# EAGLE schematic 3piRB (EAGLE 8.0.2)

## Sheet 1 of 9: CPU Control Processor Unit - XMEGA
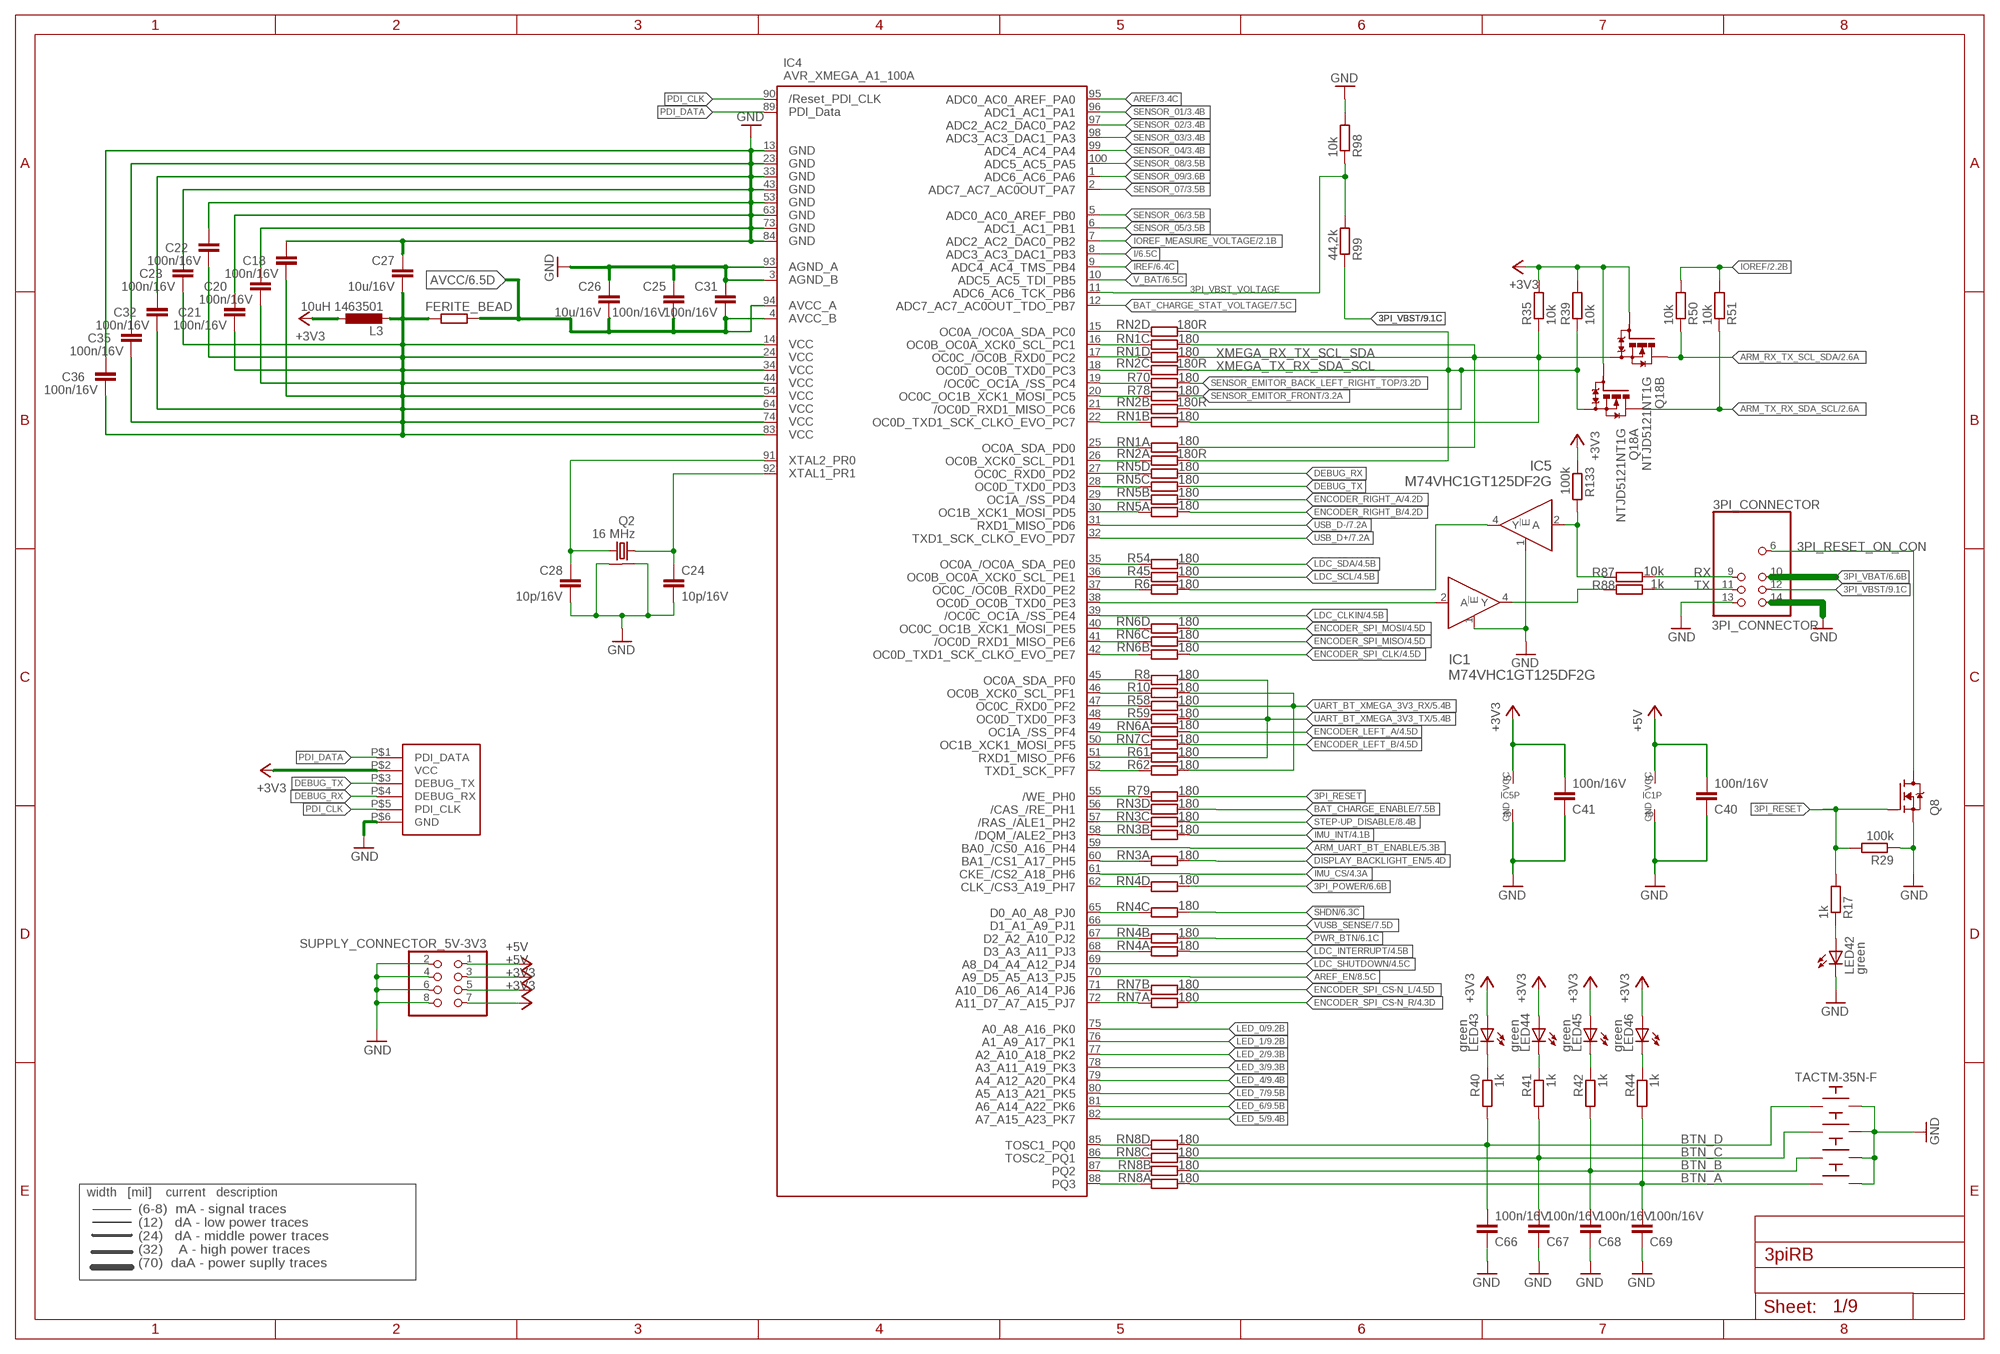
[diagram p0: schematic, sheet 1]

### Parts
3PI_CONNECTOR  3PI_CONNECTOR  3PI_BT_CONNECTOR  [3PI_BT_CONNECTOR]
BTN_A  TACTM-35N-F  [TACTM-35N-F]
BTN_B  TACTM-35N-F  [TACTM-35N-F]
BTN_C  TACTM-35N-F  [TACTM-35N-F]
BTN_D  TACTM-35N-F  [TACTM-35N-F]
C18  100n/16V  C-EUC0402  [C0402]
C20  100n/16V  C-EUC0402  [C0402]
C21  100n/16V  C-EUC0402  [C0402]
C22  100n/16V  C-EUC0402  [C0402]
C23  100n/16V  C-EUC0402  [C0402]
C24  10p/16V  C-EUC0603  [C0603]
C25  100n/16V  C-EUC0402  [C0402]
C26  10u/16V  C-EUC0805  [C0805]
C27  10u/16V  C-EUC0805  [C0805]
C28  10p/16V  C-EUC0603  [C0603]
C31  100n/16V  C-EUC0402  [C0402]
C32  100n/16V  C-EUC0402  [C0402]
C35  100n/16V  C-EUC0402  [C0402]
C36  100n/16V  C-EUC0402  [C0402]
C40  100n/16V  C-EUC0402  [C0402]
C41  100n/16V  C-EUC0402  [C0402]
C66  100n/16V  C-EUC0402  [C0402]
C67  100n/16V  C-EUC0402  [C0402]
C68  100n/16V  C-EUC0402  [C0402]
C69  100n/16V  C-EUC0402  [C0402]
FERITE_BEAD  R-EU_R0603  [R0603]
IC1  M74VHC1GT125DF2G  741G125  [SOT353]
IC4  AVR_XMEGA_A1_100A  [TQFP100]
IC5  M74VHC1GT125DF2G  741G125  [SOT353]
JP3  CON_PROG-6SMD  [SMD-6]
L3  10uH 1463501  L-EUSMD0603  [R0603]
LED42  green  LEDCHIPLED_0603  [CHIPLED_0603]
LED43  green  LEDCHIPLED_0603  [CHIPLED_0603]
LED44  green  LEDCHIPLED_0603  [CHIPLED_0603]
LED45  green  LEDCHIPLED_0603  [CHIPLED_0603]
LED46  green  LEDCHIPLED_0603  [CHIPLED_0603]
Q2  16 MHz  ABM8  [ABM8]
Q8  N-MOSFET-SOT323-GSD  [SOT323]
Q18  NTJD5121NT1G  [SOT363]
R6  180  RESISTOR_0402MP  [_0402MP]
R8  180  RESISTOR_0402MP  [_0402MP]
R10  180  RESISTOR_0402MP  [_0402MP]
R17  1k  RESISTOR_0402MP  [_0402MP]
R29  100k  RESISTOR_0402MP  [_0402MP]
R35  10k  RESISTOR_0402MP  [_0402MP]
R39  10k  RESISTOR_0402MP  [_0402MP]
R40  1k  RESISTOR_0402MP  [_0402MP]
R41  1k  RESISTOR_0402MP  [_0402MP]
R42  1k  RESISTOR_0402MP  [_0402MP]
R44  1k  RESISTOR_0402MP  [_0402MP]
R45  180  RESISTOR_0402MP  [_0402MP]
R50  10k  RESISTOR_0402MP  [_0402MP]
R51  10k  RESISTOR_0402MP  [_0402MP]
R54  180  RESISTOR_0402MP  [_0402MP]
R58  180  RESISTOR_0402MP  [_0402MP]
R59  180  RESISTOR_0402MP  [_0402MP]
R61  180  RESISTOR_0402MP  [_0402MP]
R62  180  RESISTOR_0402MP  [_0402MP]
R70  180  RESISTOR_0402MP  [_0402MP]
R78  180  RESISTOR_0402MP  [_0402MP]
R79  180  RESISTOR_0402MP  [_0402MP]
R87  10k  RESISTOR_0402MP  [_0402MP]
R88  1k  RESISTOR_0402MP  [_0402MP]
R98  10k  RESISTOR_0402MP  [_0402MP]
R99  44,2k  RESISTOR_0402MP  [_0402MP]
R133  100k  RESISTOR_0402MP  [_0402MP]
RN1  180  742-8_MULTI  [742-8]
RN2  180R  742-8_MULTI  [742-8]
RN3  180  742-8_MULTI  [742-8]
RN4  180  742-8_MULTI  [742-8]
RN5  180  742-8_MULTI  [742-8]
RN6  180  742-8_MULTI  [742-8]
RN7  180  742-8_MULTI  [742-8]
RN8  180  742-8_MULTI  [742-8]
SUPPLY_CONNECTOR_5V-3V3  PINHD-2X4  [2X04]

### Nets
3PI-POWER: IC4.56(PH1) RN3.4
3PI_POWER: RN4.5 ; also sheet 6
3PI_RESET: Q8.1(G) R17.2 R29.2 R79.2
3PI_RESET_: IC4.55(PH0) R79.1
3PI_RESET_ON_CON: 3PI_CONNECTOR.6 Q8.3(D)
3PI_VBAT: 3PI_CONNECTOR.10 ; also sheet 6,9
3PI_VBST: 3PI_CONNECTOR.12 R99.1 ; also sheet 9
3PI_VBST_VOLTAGE: IC4.11(PB6) R98.1 R99.2
3V3-L3-VCC_XMEGA: C18.2 C20.2 C21.2 C22.2 C23.2 C27.2 C32.2 C35.2 C36.2 FERITE_BEAD.2 IC4.14(VCC1) IC4.24(VCC2) IC4.34(VCC3) IC4.44(VCC4) IC4.54(VCC5) IC4.64(VCC6) IC4.74(VCC7) IC4.83(VCC8) L3.2
!SHDN: RN4.6 ; also sheet 6
+3V3: C41.2 IC5.5(VCC) JP3.P$2(VCC) L3.1 LED43.A LED44.A LED45.A LED46.A Q18.2(A:G) Q18.5(B:G) R35.2 R39.2 R133.1 SUPPLY_CONNECTOR_5V-3V3.5 SUPPLY_CONNECTOR_5V-3V3.7 ; also sheet 4,5,6,7,8,9
+5V: C40.2 IC1.5(VCC) SUPPLY_CONNECTOR_5V-3V3.1 SUPPLY_CONNECTOR_5V-3V3.3 ; also sheet 2,3,5,7,8,9
AREF: IC4.95(PA0) ; also sheet 3,8,9
AREF_EN: IC4.70(PJ5) ; also sheet 8
ARM_RX_TX_SCL_SDA: Q18.3(B:D) R50.1 ; also sheet 2
ARM_TX_RX_SDA_SCL: Q18.6(A:D) R51.1 ; also sheet 2
ARM_UART_BT_ENABLE: IC4.59(PH4) ; also sheet 5
AVCC: C25.2 C26.2 C31.2 FERITE_BEAD.1 IC4.4(AVCC_B) IC4.94(AVCC_A) ; also sheet 6,7,8
BAT_CHARGE_ENABLE: RN3.5 ; also sheet 7
BAT_CHARGE_ENABLE-A: IC4.62(PH7) RN4.4
BAT_CHARGE_STAT_VOLTAGE: IC4.12(PB7) ; also sheet 7
BTN_A: BTN_A.P$2 C69.2 R44.2 RN8.8
BTN_A_: IC4.88(PQ3) RN8.1
BTN_B: BTN_B.P$2 C68.2 R42.2 RN8.7
BTN_B_: IC4.87(PQ2) RN8.2
BTN_C: BTN_C.P$2 C67.2 R41.2 RN8.6
BTN_C_: IC4.86(PQ1) RN8.3
BTN_D: BTN_D.P$2 C66.2 R40.2 RN8.5
BTN_D_: IC4.85(PQ0) RN8.4
DEBUG_RX: JP3.P$4(DEBUG_RX) RN5.5
DEBUG_RX_: IC4.27(PD2) RN5.4
DEBUG_TX: JP3.P$3(DEBUG_TX) RN5.6
DEBUG_TX_: IC4.28(PD3) RN5.3
DISPLAY_BACKLIGHT-EN: IC4.65(PJ0) RN4.3
DISPLAY_BACKLIGHT_EN: RN3.8 ; also sheet 5
ENCODER_LEFT_A: RN6.8 ; also sheet 4
ENCODER_LEFT_A_: IC4.29(PD4) RN5.2
ENCODER_LEFT_B: RN7.6 ; also sheet 4
ENCODER_LEFT_B_: IC4.30(PD5) RN5.1
ENCODER_RIGHT_A: RN5.7 ; also sheet 4
ENCODER_RIGHT_A_: IC4.49(PF4) RN6.1
ENCODER_RIGHT_B: RN5.8 ; also sheet 4
ENCODER_RIGHT_B_: IC4.50(PF5) RN7.3
ENCODER_SPI_CLK: RN6.7 ; also sheet 4
ENCODER_SPI_CLK_: IC4.42(PE7) RN6.2
ENCODER_SPI_CS-N_L: RN7.7 ; also sheet 4
ENCODER_SPI_CS-N_L_: IC4.71(PJ6) RN7.2
ENCODER_SPI_CS-N_R: RN7.8 ; also sheet 4
ENCODER_SPI_CS-N_R_: IC4.72(PJ7) RN7.1
ENCODER_SPI_MISO: RN6.6 ; also sheet 4
ENCODER_SPI_MISO_: IC4.41(PE6) RN6.3
ENCODER_SPI_MOSI: RN6.5 ; also sheet 4
ENCODER_SPI_MOSI_: IC4.40(PE5) RN6.4
GND: 3PI_CONNECTOR.13 3PI_CONNECTOR.14 BTN_A.P$4 BTN_B.P$4 BTN_C.P$4 BTN_D.P$4 C18.1 C20.1 C21.1 C22.1 C23.1 C24.2 C25.1 C26.1 C27.1 C28.2 C31.1 C32.1 C35.1 C36.1 C40.1 C41.1 C66.1 C67.1 C68.1 C69.1 IC1.1(!E) IC1.3(GND) IC4.3(AGND_B) IC4.13(GND1) IC4.23(GND2) IC4.33(GND3) IC4.43(GND4) IC4.53(GND5) IC4.63(GND6) IC4.73(GND7) IC4.84(GND8) IC4.93(AGND_A) IC5.1(!E) IC5.3(GND) JP3.P$6(GND) LED42.C Q2.GND$1 Q2.GND$2 Q8.2(S) R29.1 R98.2 SUPPLY_CONNECTOR_5V-3V3.2 SUPPLY_CONNECTOR_5V-3V3.4 SUPPLY_CONNECTOR_5V-3V3.6 SUPPLY_CONNECTOR_5V-3V3.8 ; also sheet 2,3,4,5,6,7,8,9
I: IC4.8(PB3) ; also sheet 6
IMU-ENT: IC4.58(PH3) RN3.2
IMU_CS: IC4.61(PH6) ; also sheet 4
IMU_INT: RN3.7 ; also sheet 4
IOREF: R50.2 R51.2 ; also sheet 2,5,9
IOREF_MEASURE_VOLTAGE: IC4.7(PB2) ; also sheet 2
IREF: IC4.9(PB4) ; also sheet 6
LDC_CLKIN: IC4.39(PE4) ; also sheet 4
LDC_INTERRUPT: RN4.8 ; also sheet 4
LDC_INTERRUPT_: IC4.68(PJ3) RN4.1
LDC_SCL: R45.1 ; also sheet 4
LDC_SCL_: IC4.36(PE1) R45.2
LDC_SDA: R54.1 ; also sheet 4
LDC_SDA_: IC4.35(PE0) R54.2
LDC_SHUTDOWN: IC4.69(PJ4) ; also sheet 4
LED_0: IC4.75(PK0) ; also sheet 9
LED_1: IC4.76(PK1) ; also sheet 9
LED_2: IC4.77(PK2) ; also sheet 9
LED_3: IC4.78(PK3) ; also sheet 9
LED_4: IC4.79(PK4) ; also sheet 9
LED_5: IC4.82(PK7) ; also sheet 9
LED_6: IC4.81(PK6) ; also sheet 9
LED_7: IC4.80(PK5) ; also sheet 9
LED_R_20: LED42.A R17.1
N$8: LED43.C R40.1
N$11: LED44.C R41.1
N$12: LED45.C R42.1
N$17: LED46.C R44.1
PDI_CLK: IC4.90(RESET) JP3.P$5(PDI_CLK)
PDI_DATA: IC4.89(PDI_DATA) JP3.P$1(PDI_DATA)
PWR_BTN: RN4.7 ; also sheet 6
PWR_BTN_: IC4.57(PH2) RN3.3
SENSOR_01: IC4.96(PA1) ; also sheet 3
SENSOR_02: IC4.97(PA2) ; also sheet 3
SENSOR_03: IC4.98(PA3) ; also sheet 3
SENSOR_04: IC4.99(PA4) ; also sheet 3
SENSOR_05: IC4.6(PB1) ; also sheet 3
SENSOR_06: IC4.5(PB0) ; also sheet 3
SENSOR_07: IC4.2(PA7) ; also sheet 3
SENSOR_08: IC4.100(PA5) ; also sheet 3
SENSOR_09: IC4.1(PA6) ; also sheet 3
SENSOR_EMITOR_BACK_LEFT_RIGHT_TOP: R70.2 ; also sheet 3
SENSOR_EMITOR_BACK_LEFT_RIGHT_TOP_: IC4.20(PC5) R78.1
SENSOR_EMITOR_FRONT: R78.2 ; also sheet 3
SENSOR_EMITOR_FRONT_: IC4.19(PC4) R70.1
SHDN_: IC4.67(PJ2) RN4.2
STEP-UP_DISABLE: RN3.6 ; also sheet 8
STEP-UP_DISABLE_: IC4.60(PH5) RN3.1
UART_3V3_3PI_RX: IC5.4(Y) R6.2
UART_3V3_3PI_RX_: IC4.37(PE2) R6.1
UART_3V3_3PI_TX: IC1.2(A) IC4.38(PE3)
UART_5V_3PI_RX: IC5.2(A) R87.1 R133.2
UART_5V_3PI_RX_J: 3PI_CONNECTOR.9 R87.2
UART_5V_3PI_TX: IC1.4(Y) R88.1
UART_5V_3PI_TX_J: 3PI_CONNECTOR.11 R88.2
UART_BT_XMEGA_3V3_RX: R10.2 R58.2 R62.2 ; also sheet 5
UART_BT_XMEGA_3V3_RX_PF1-SCL: IC4.46(PF1) R10.1
UART_BT_XMEGA_3V3_RX_PF2-RXD0: IC4.47(PF2) R58.1
UART_BT_XMEGA_3V3_RX_PF7-TXD1: IC4.52(PF7) R62.1
UART_BT_XMEGA_3V3_TX: R8.2 R59.2 R61.2 ; also sheet 5
UART_BT_XMEGA_3V3_TX_PF0-SDA: IC4.45(PF0) R8.1
UART_BT_XMEGA_3V3_TX_PF3-TXD0: IC4.48(PF3) R59.1
UART_BT_XMEGA_3V3_TX_PF6-RXD1: IC4.51(PF6) R61.1
USB_D+: IC4.32(PD7) ; also sheet 7
USB_D-: IC4.31(PD6) ; also sheet 7
V_BAT: IC4.10(PB5) ; also sheet 6
VUSB_SENSE: IC4.66(PJ1) ; also sheet 7
XMEGA_RX_TX_SCL_SDA: Q18.4(B:S) R35.1 RN1.5 RN1.6 RN1.7 RN1.8
XMEGA_RX_TX_SCL_SDA_PC1-SCL: IC4.16(PC1) RN1.3
XMEGA_RX_TX_SCL_SDA_PC2-RXD0: IC4.17(PC2) RN1.4
XMEGA_RX_TX_SCL_SDA_PC7-TXD1: IC4.22(PC7) RN1.2
XMEGA_RX_TX_SCL_SDA_PD0-SDA: IC4.25(PD0) RN1.1
XMEGA_TX_RX_SDA_SCL: Q18.1(A:S) R39.1 RN2.5 RN2.6 RN2.7 RN2.8
XMEGA_TX_RX_SDA_SCL_PC0-SDA: IC4.15(PC0) RN2.4
XMEGA_TX_RX_SDA_SCL_PC3-TXD0: IC4.18(PC3) RN2.3
XMEGA_TX_RX_SDA_SCL_PC6-RXD1: IC4.21(PC6) RN2.2
XMEGA_TX_RX_SDA_SCL_PD1-SCL: IC4.26(PD1) RN2.1
XTAL1: C24.1 IC4.92(PR1) Q2.Q$1
XTAL2: C28.1 IC4.91(PR0) Q2.Q$2
Unconnected: RN7.4 RN7.5

### Notes on the sheet
- RX
- TX
- width   [mil]    current   description
- (6-8)  mA - signal traces
  (12)   dA - low power traces
  (24)   dA - middle power traces
  (32)    A - high power traces
  (70)  daA - power suplly traces

## Sheet 2 of 9: UP User Processor - Mbed / Arduino
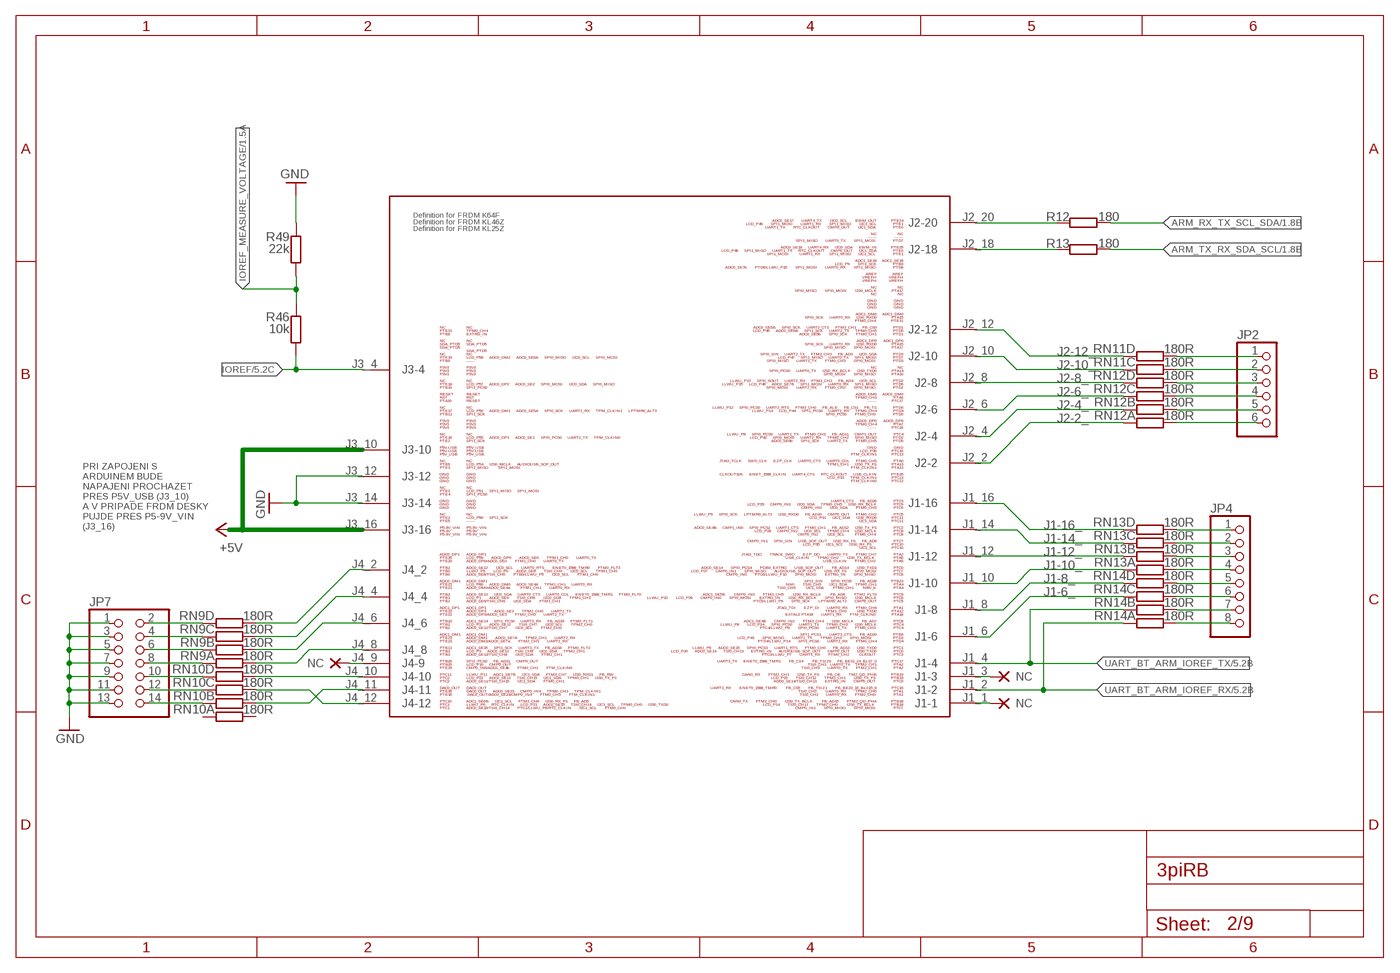
[diagram p1: schematic, sheet 2, overview]
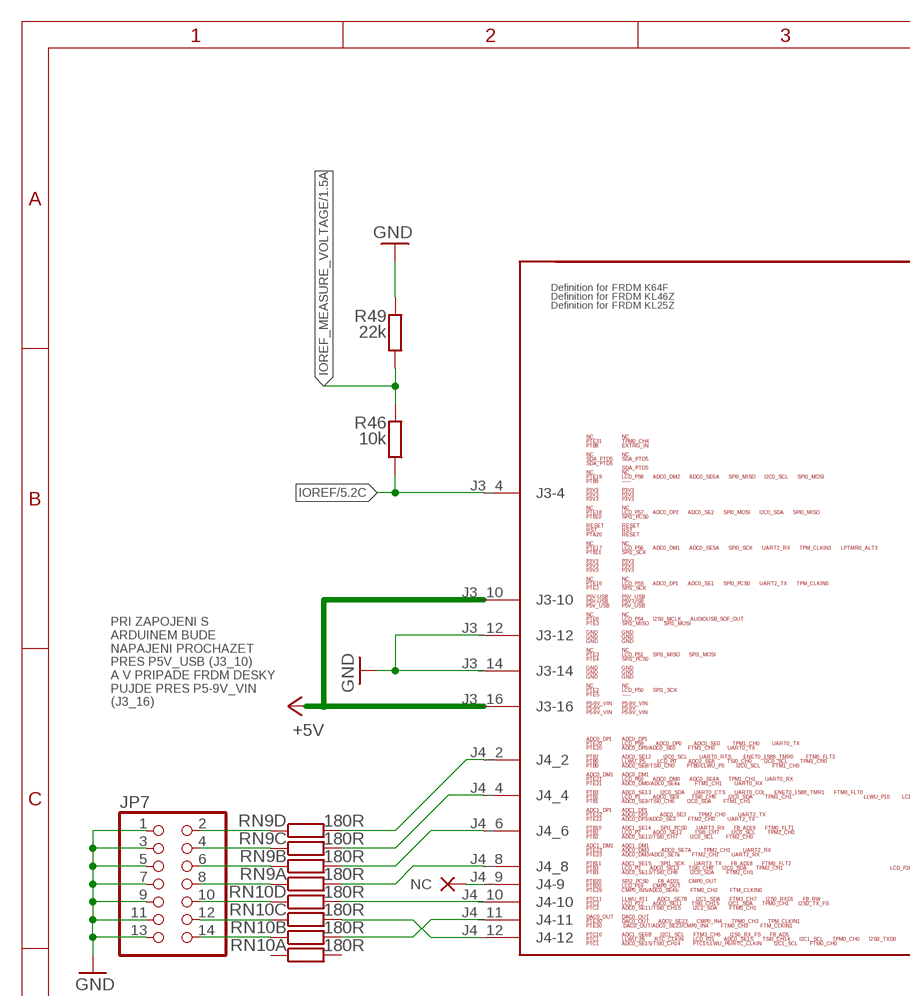
[diagram p2: schematic, sheet 2, part 1 of 4]
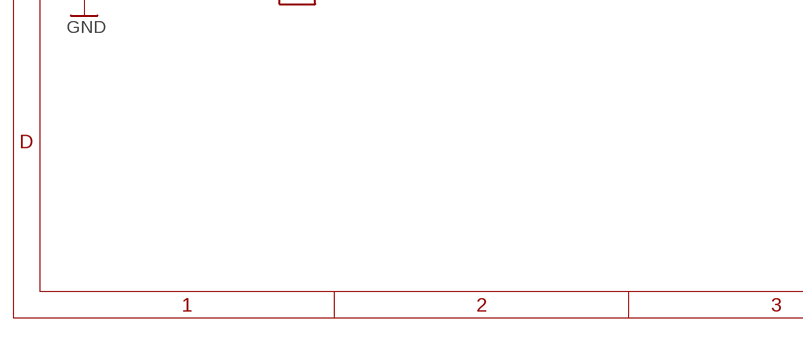
[diagram p3: schematic, sheet 2, part 2 of 4]
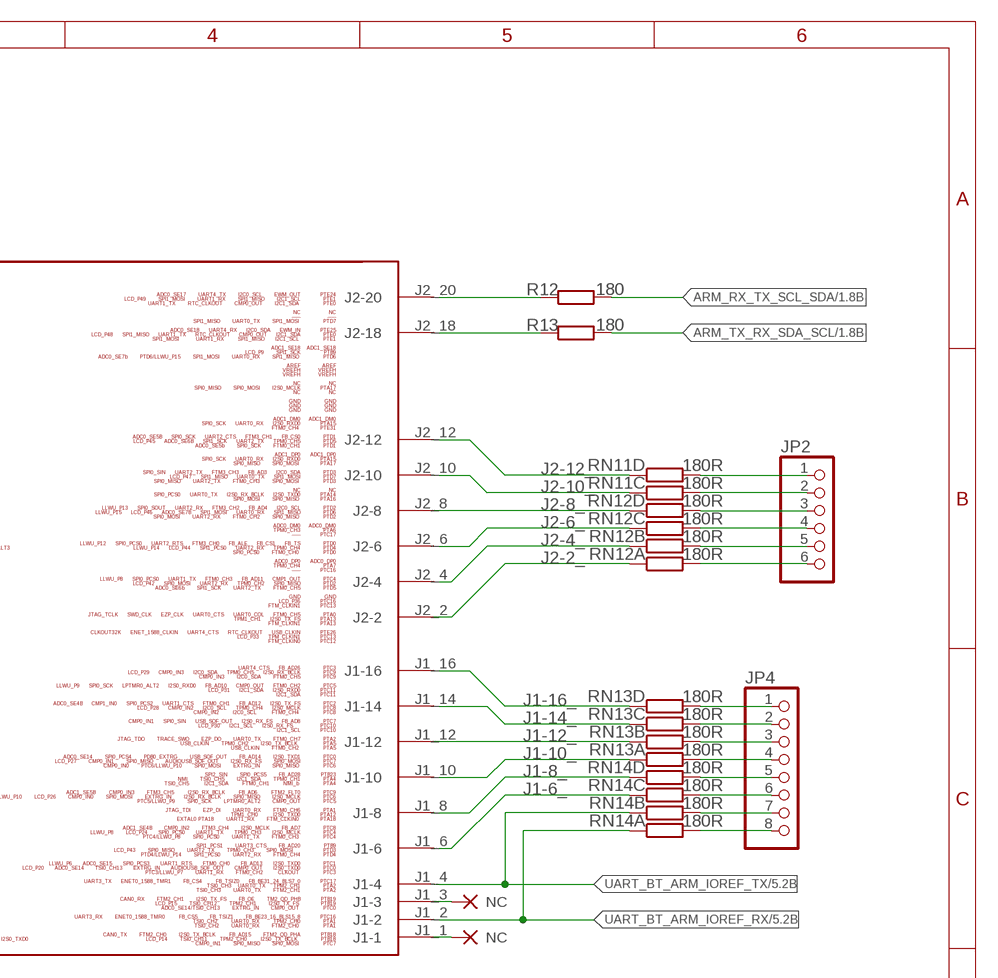
[diagram p4: schematic, sheet 2, part 3 of 4]
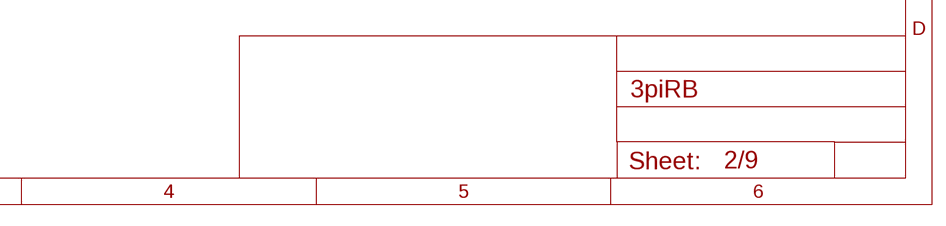
[diagram p5: schematic, sheet 2, part 4 of 4]

### Parts
JP2  PINHD-1X6  [1X06]
JP4  PINHD-1X8  [1X08]
JP7  PINHD-2X7  [2X07]
NC24  NC  (no package)
NC28  NC  (no package)
NC29  NC  (no package)
R12  180  RESISTOR_0402MP  [_0402MP]
R13  180  RESISTOR_0402MP  [_0402MP]
R46  10k  RESISTOR_0402MP  [_0402MP]
R49  22k  RESISTOR_0402MP  [_0402MP]
RN9  180R  742-8_MULTI  [742-8]
RN10  180R  742-8_MULTI  [742-8]
RN11  180R  742-8_MULTI  [742-8]
RN12  180R  742-8_MULTI  [742-8]
RN13  180R  742-8_MULTI  [742-8]
RN14  180R  742-8_MULTI  [742-8]
U$1  FRDM-KL25Z+KL46Z+K64F_MORE_PINS  [FRDM-KL25Z+KL46Z+K64F_MORE_PINS]

### Nets
+5V: U$1.J3_10(J3-10) U$1.J3_16(J3-16) ; also sheet 1,3,5,7,8,9
ARM_RX_TX_SCL_SDA: R12.2 ; also sheet 1
ARM_RX_TX_SCL_SDA_: R12.1 U$1.J2_20(J2-20)
ARM_TX_RX_SDA_SCL: R13.2 ; also sheet 1
ARM_TX_RX_SDA_SCL_: R13.1 U$1.J2_18(J2-18)
GND: JP7.1 JP7.3 JP7.5 JP7.7 JP7.9 JP7.11 JP7.13 R49.2 U$1.J3_12(J3-12) U$1.J3_14(J3-14) ; also sheet 1,3,4,5,6,7,8,9
IOREF: R46.1 U$1.J3_4(J3-4) ; also sheet 1,5,9
IOREF_MEASURE_VOLTAGE: R46.2 R49.1 ; also sheet 1
J1-2: JP4.8 RN14.8
J1-4: JP4.7 RN14.7
J1-6: JP4.6 RN14.6
J1-6_: RN14.3 U$1.J1_6(J1-6)
J1-8: JP4.5 RN14.5
J1-8_: RN14.4 U$1.J1_8(J1-8)
J1-10: JP4.4 RN13.8
J1-10_: RN13.1 U$1.J1_10(J1-10)
J1-12: JP4.3 RN13.7
J1-12_: RN13.2 U$1.J1_12(J1-12)
J1-14: JP4.2 RN13.6
J1-14_: RN13.3 U$1.J1_14(J1-14)
J1-16: JP4.1 RN13.5
J1-16_: RN13.4 U$1.J1_16(J1-16)
J2-2: JP2.6 RN12.8
J2-2_: RN12.1 U$1.J2_2(J2-2)
J2-4: JP2.5 RN12.7
J2-4_: RN12.2 U$1.J2_4(J2-4)
J2-6: JP2.4 RN12.6
J2-6_: RN12.3 U$1.J2_6(J2-6)
J2-8: JP2.3 RN12.5
J2-8_: RN12.4 U$1.J2_8(J2-8)
J2-10: JP2.2 RN11.6
J2-10_: RN11.3 U$1.J2_10(J2-10)
J2-12: JP2.1 RN11.5
J2-12_: RN11.4 U$1.J2_12(J2-12)
J4-2: JP7.2 RN9.4
J4-2_: RN9.5 U$1.J4_2
J4-4: JP7.4 RN9.3
J4-4_: RN9.6 U$1.J4_4
J4-6: JP7.6 RN9.2
J4-6_: RN9.7 U$1.J4_6
J4-8: JP7.8 RN9.1
J4-8_: RN9.8 U$1.J4_8
J4-10: JP7.10 RN10.4
J4-10_: RN10.5 U$1.J4_10(J4-10)
J4-11: JP7.14 RN10.2
J4-11_: RN10.7 U$1.J4_11(J4-11)
J4-12: JP7.12 RN10.3
J4-12_: RN10.6 U$1.J4_12(J4-12)
N$1: NC24.NC U$1.J4_9(J4-9)
N$9: NC28.NC U$1.J1_1(J1-1)
N$10: NC29.NC U$1.J1_3(J1-3)
UART_BT_ARM_IOREF_RX: RN14.1 U$1.J1_2(J1-2) ; also sheet 5
UART_BT_ARM_IOREF_TX: RN14.2 U$1.J1_4(J1-4) ; also sheet 5
Unconnected: RN10.1 RN10.8 RN11.1 RN11.2 RN11.7 RN11.8

### Notes on the sheet
- PRI ZAPOJENI S
  ARDUINEM BUDE
  NAPAJENI PROCHAZET
  PRES P5V_USB (J3_10)
  A V PRIPADE FRDM DESKY
  PUJDE PRES P5-9V_VIN
  (J3_16)

## Sheet 3 of 9: IR_SENSORS
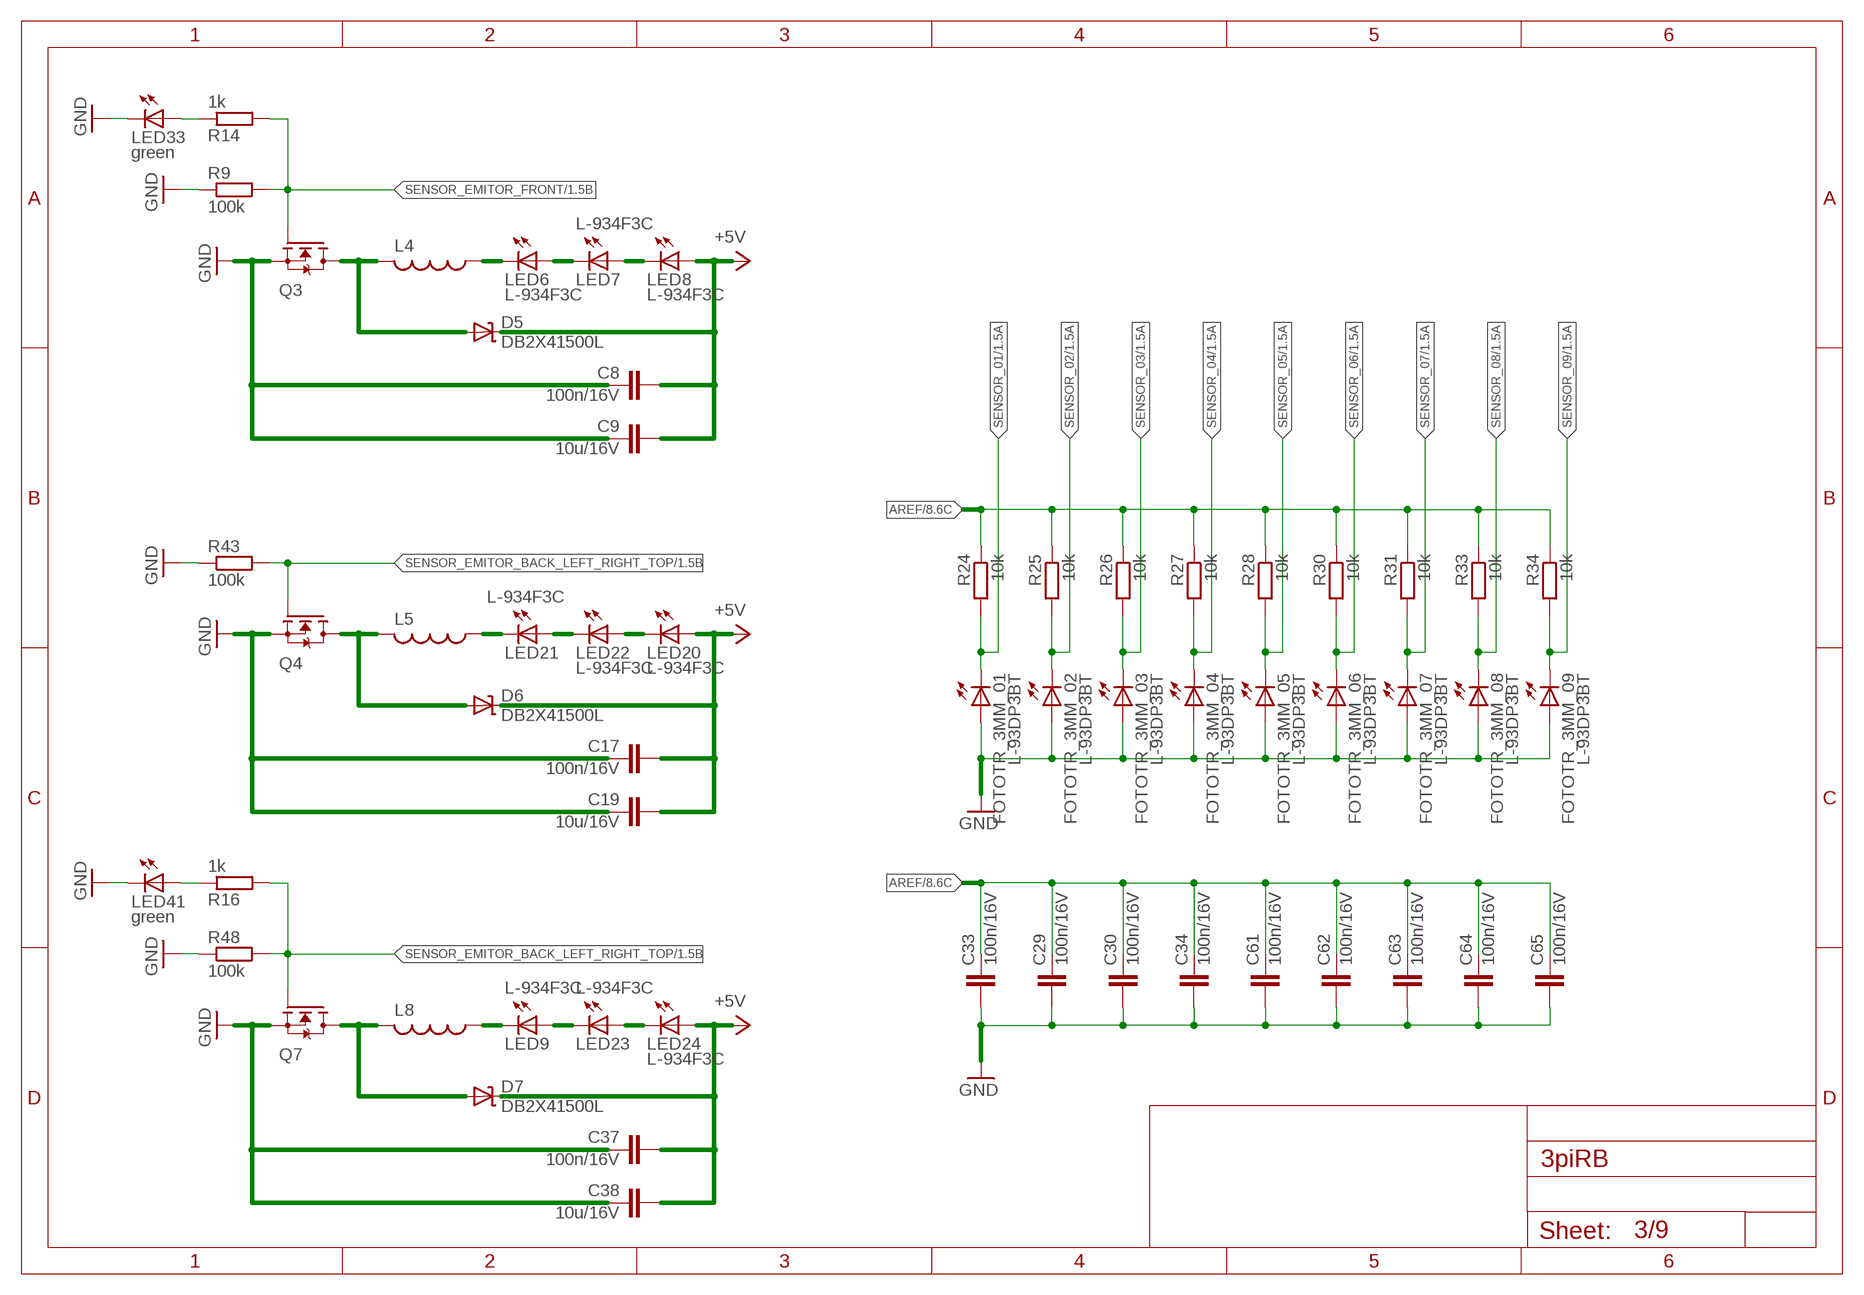
[diagram p6: schematic, sheet 3]

### Parts
C8  100n/16V  C-EUC0402  [C0402]
C9  10u/16V  C-EUC0805  [C0805]
C17  100n/16V  C-EUC0402  [C0402]
C19  10u/16V  C-EUC0805  [C0805]
C29  100n/16V  C-EUC0402  [C0402]
C30  100n/16V  C-EUC0402  [C0402]
C33  100n/16V  C-EUC0402  [C0402]
C34  100n/16V  C-EUC0402  [C0402]
C37  100n/16V  C-EUC0402  [C0402]
C38  10u/16V  C-EUC0805  [C0805]
C61  100n/16V  C-EUC0402  [C0402]
C62  100n/16V  C-EUC0402  [C0402]
C63  100n/16V  C-EUC0402  [C0402]
C64  100n/16V  C-EUC0402  [C0402]
C65  100n/16V  C-EUC0402  [C0402]
D5  DB2X41500L  SHOTTKY-SOD123  [SOD123]
D6  DB2X41500L  SHOTTKY-SOD123  [SOD123]
D7  DB2X41500L  SHOTTKY-SOD123  [SOD123]
FOTOTR_3MM_01  L-93DP3BT  LED3MM  [LED3MM]
FOTOTR_3MM_02  L-93DP3BT  LED3MM  [LED3MM]
FOTOTR_3MM_03  L-93DP3BT  LED3MM  [LED3MM]
FOTOTR_3MM_04  L-93DP3BT  LED3MM  [LED3MM]
FOTOTR_3MM_05  L-93DP3BT  LED3MM  [LED3MM]
FOTOTR_3MM_06  L-93DP3BT  LED3MM  [LED3MM]
FOTOTR_3MM_07  L-93DP3BT  LED3MM  [LED3MM]
FOTOTR_3MM_08  L-93DP3BT  LED3MM  [LED3MM]
FOTOTR_3MM_09  L-93DP3BT  LED3MM  [LED3MM]
L4  L-USL0805  [R0805@1]
L5  L-USL0805  [R0805@1]
L8  L-USL0805  [R0805@1]
LED6  L-934F3C  LED3MM  [LED3MM]
LED7  L-934F3C  LED3MM  [LED3MM]
LED8  L-934F3C  LED3MM  [LED3MM]
LED9  L-934F3C  LED3MM  [LED3MM]
LED20  L-934F3C  LED3MM  [LED3MM]
LED21  L-934F3C  LED3MM  [LED3MM]
LED22  L-934F3C  LED3MM  [LED3MM]
LED23  L-934F3C  LED3MM  [LED3MM]
LED24  L-934F3C  LED3MM  [LED3MM]
LED33  green  LEDCHIPLED_0603  [CHIPLED_0603]
LED41  green  LEDCHIPLED_0603  [CHIPLED_0603]
Q3  N-MOSFET-SOT323-GSD  [SOT323]
Q4  N-MOSFET-SOT323-GSD  [SOT323]
Q7  N-MOSFET-SOT323-GSD  [SOT323]
R9  100k  RESISTOR_0402MP  [_0402MP]
R14  1k  RESISTOR_0402MP  [_0402MP]
R16  1k  RESISTOR_0402MP  [_0402MP]
R24  10k  RESISTOR_0402MP  [_0402MP]
R25  10k  RESISTOR_0402MP  [_0402MP]
R26  10k  RESISTOR_0402MP  [_0402MP]
R27  10k  RESISTOR_0402MP  [_0402MP]
R28  10k  RESISTOR_0402MP  [_0402MP]
R30  10k  RESISTOR_0402MP  [_0402MP]
R31  10k  RESISTOR_0402MP  [_0402MP]
R33  10k  RESISTOR_0402MP  [_0402MP]
R34  10k  RESISTOR_0402MP  [_0402MP]
R43  100k  RESISTOR_0402MP  [_0402MP]
R48  100k  RESISTOR_0402MP  [_0402MP]

### Nets
+5V: C8.1 C9.1 C17.1 C19.1 C37.1 C38.1 D5.C D6.C D7.C LED8.A LED20.A LED24.A ; also sheet 1,2,5,7,8,9
AREF: C29.2 C30.2 C33.2 C34.2 C61.2 C62.2 C63.2 C64.2 C65.2 R24.1 R25.1 R26.1 R27.1 R28.1 R30.1 R31.1 R33.1 R34.1 ; also sheet 1,8,9
GND: C8.2 C9.2 C17.2 C19.2 C29.1 C30.1 C33.1 C34.1 C37.2 C38.2 C61.1 C62.1 C63.1 C64.1 C65.1 FOTOTR_3MM_01.A FOTOTR_3MM_02.A FOTOTR_3MM_03.A FOTOTR_3MM_04.A FOTOTR_3MM_05.A FOTOTR_3MM_06.A FOTOTR_3MM_07.A FOTOTR_3MM_08.A FOTOTR_3MM_09.A LED33.C LED41.C Q3.2(S) Q4.2(S) Q7.2(S) R9.1 R43.1 R48.1 ; also sheet 1,2,4,5,6,7,8,9
LED_R_8: LED33.A R14.1
LED_R_19: LED41.A R16.1
N$18: LED20.K(C) LED22.A
N$19: LED21.A LED22.K(C)
N$20: L5.1 LED21.K(C)
SENSOR_01: FOTOTR_3MM_01.K(C) R24.2 ; also sheet 1
SENSOR_02: FOTOTR_3MM_02.K(C) R25.2 ; also sheet 1
SENSOR_03: FOTOTR_3MM_03.K(C) R26.2 ; also sheet 1
SENSOR_04: FOTOTR_3MM_04.K(C) R27.2 ; also sheet 1
SENSOR_05: FOTOTR_3MM_05.K(C) R28.2 ; also sheet 1
SENSOR_06: FOTOTR_3MM_06.K(C) R30.2 ; also sheet 1
SENSOR_07: FOTOTR_3MM_07.K(C) R31.2 ; also sheet 1
SENSOR_08: FOTOTR_3MM_08.K(C) R33.2 ; also sheet 1
SENSOR_09: FOTOTR_3MM_09.K(C) R34.2 ; also sheet 1
SENSOR_EMITOR_BACK_COIL: D6.A L5.2 Q4.3(D)
SENSOR_EMITOR_BACK_LEFT_RIGHT_TOP: Q4.1(G) Q7.1(G) R16.2 R43.2 R48.2 ; also sheet 1
SENSOR_EMITOR_FRONT: Q3.1(G) R9.2 R14.2 ; also sheet 1
SENSOR_EMITOR_FRONT_COIL: D5.A L4.2 Q3.3(D)
SENSOR_EMITOR_FRONT_L0: L4.1 LED6.K(C)
SENSOR_EMITOR_FRONT_L1: LED6.A LED7.K(C)
SENSOR_EMITOR_FRONT_L2: LED7.A LED8.K(C)
SENSOR_EMITORLEFT_RIGHT_TOP_COIL: D7.A L8.2 Q7.3(D)
SENSOR_EMITORLEFT_RIGHT_TOP_L0: L8.1 LED9.K(C)
SENSOR_EMITORLEFT_RIGHT_TOP_L1: LED9.A LED23.K(C)
SENSOR_EMITORLEFT_RIGHT_TOP_L2: LED23.A LED24.K(C)

## Sheet 4 of 9: MOTION_SENSORS
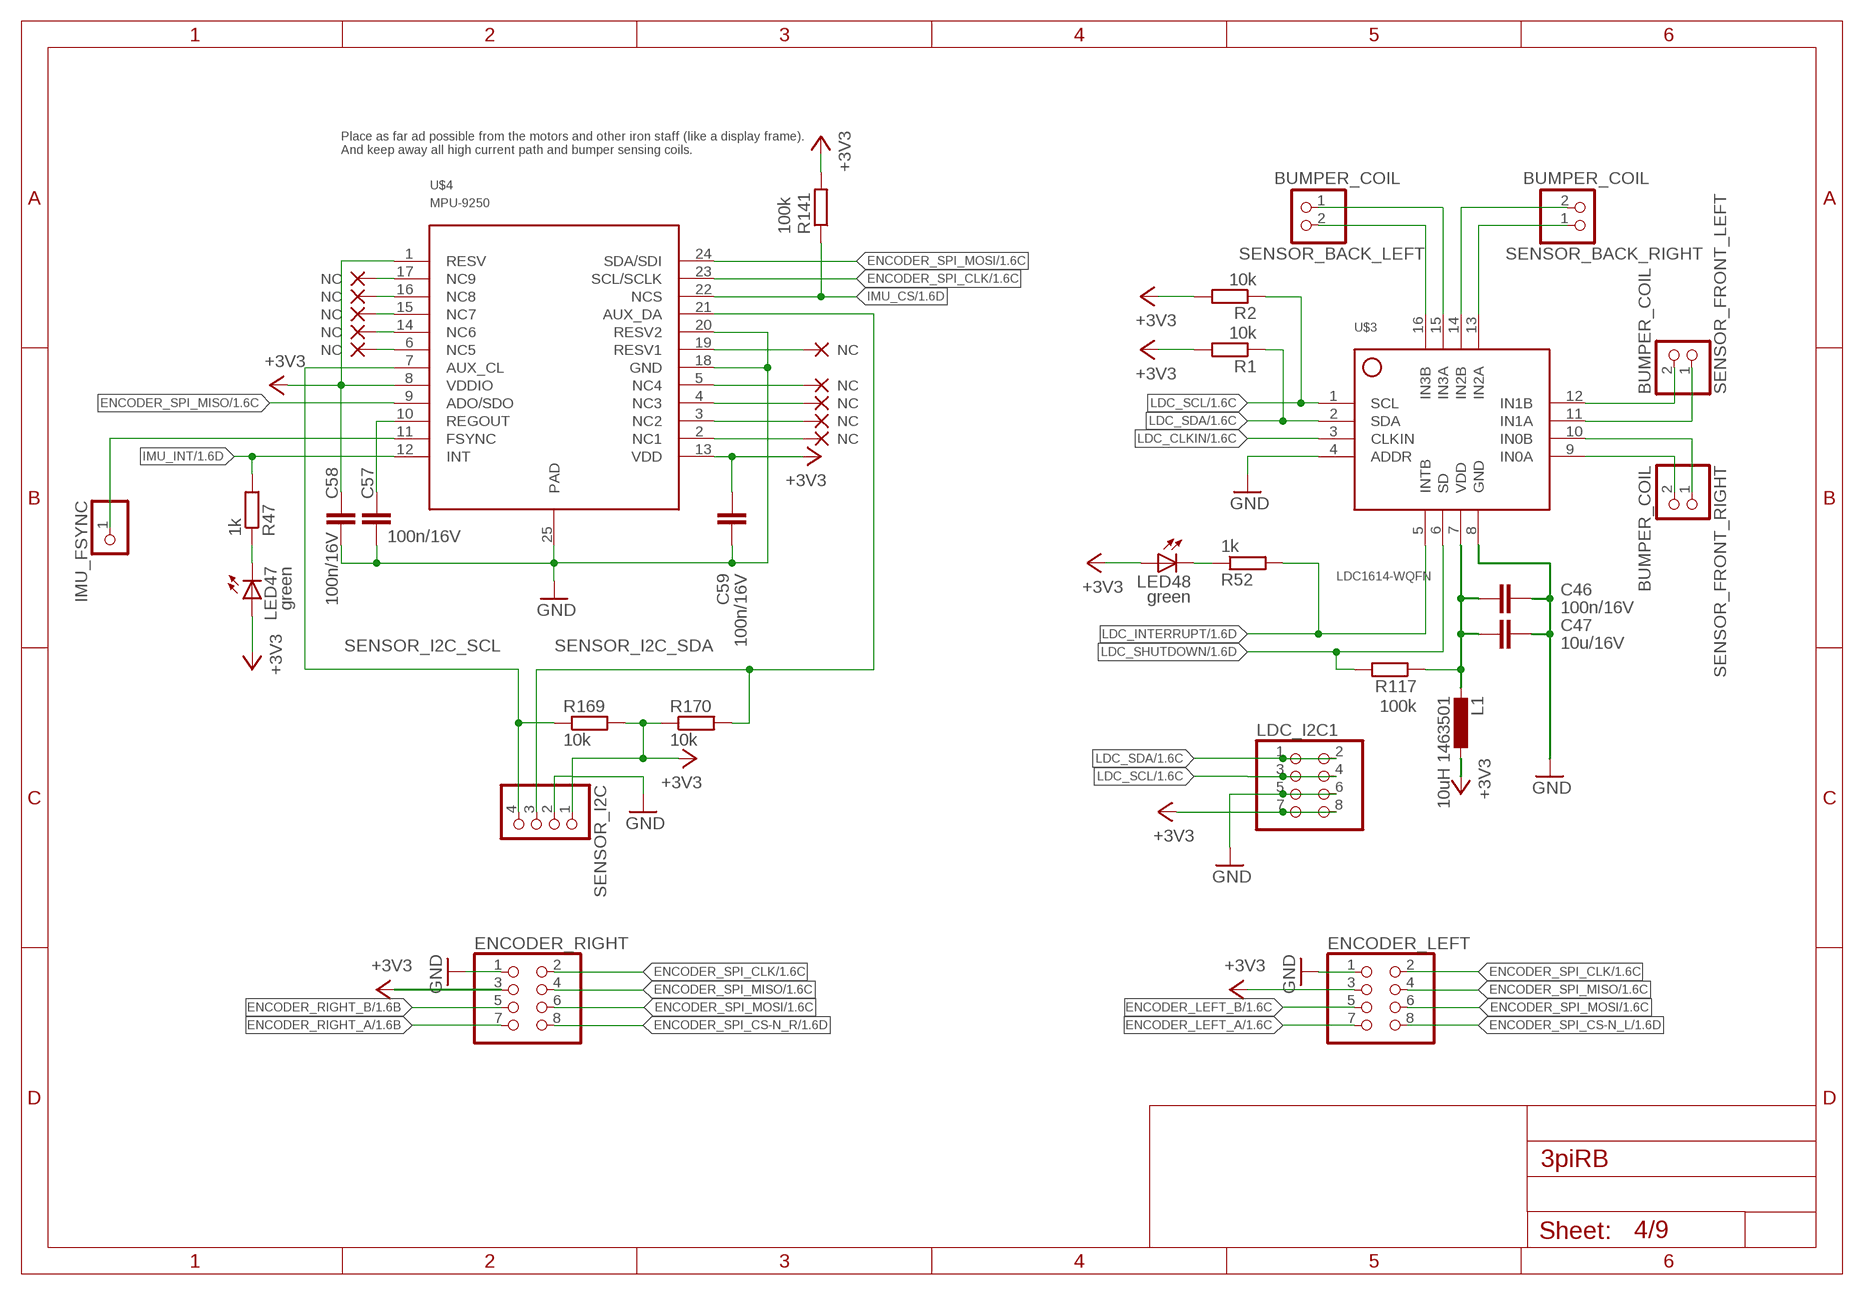
[diagram p7: schematic, sheet 4]

### Parts
C46  100n/16V  C-EUC0402  [C0402]
C47  10u/16V  C-EUC0805  [C0805]
C57  100n/16V  C-EUC0402  [C0402]
C58  100n/16V  C-EUC0402  [C0402]
C59  100n/16V  C-EUC0402  [C0402]
ENCODER_LEFT  PINHD-2X4  [2X04]
ENCODER_RIGHT  PINHD-2X4  [2X04]
IMU_FSYNC  PINHD-1X1  [1X01]
L1  10uH 1463501  L-EUSMD0603  [R0603]
LDC_I2C1  PINHD-2X4  [2X04]
LED47  green  LEDCHIPLED_0603  [CHIPLED_0603]
LED48  green  LEDCHIPLED_0603  [CHIPLED_0603]
NC1  NC  (no package)
NC2  NC  (no package)
NC3  NC  (no package)
NC4  NC  (no package)
NC59  NC  (no package)
NC60  NC  (no package)
NC61  NC  (no package)
NC62  NC  (no package)
NC63  NC  (no package)
NC64  NC  (no package)
R1  10k  RESISTOR_0402MP  [_0402MP]
R2  10k  RESISTOR_0402MP  [_0402MP]
R47  1k  RESISTOR_0402MP  [_0402MP]
R52  1k  RESISTOR_0402MP  [_0402MP]
R117  100k  RESISTOR_0402MP  [_0402MP]
R141  100k  RESISTOR_0402MP  [_0402MP]
R169  10k  RESISTOR_0402MP  [_0402MP]
R170  10k  RESISTOR_0402MP  [_0402MP]
SENSOR_BACK_LEFT  BUMPER_COIL  PINHD-1X2  [1X02]
SENSOR_BACK_RIGHT  BUMPER_COIL  PINHD-1X2  [1X02]
SENSOR_FRONT_LEFT  BUMPER_COIL  PINHD-1X2  [1X02]
SENSOR_FRONT_RIGHT  BUMPER_COIL  PINHD-1X2  [1X02]
SENSOR_I2C  PINHD-1X4  [1X04]
U$3  LDC1614-WQFN  [LDC1614-WQFN]
U$4  MPU-9250  [LEAD-QFN24]

### Nets
+3V3: C58.1 C59.2 ENCODER_LEFT.3 ENCODER_RIGHT.3 L1.1 LDC_I2C1.7 LDC_I2C1.8 LED47.A LED48.A R1.2 R2.2 R141.2 R169.2 R170.1 SENSOR_I2C.1 U$4.1(RESV) U$4.8(VDDIO) U$4.13(VDD) ; also sheet 1,5,6,7,8,9
BUMPER_BACK_LEFT_A: SENSOR_BACK_LEFT.1 U$3.15(IN3A)
BUMPER_BACK_LEFT_B: SENSOR_BACK_LEFT.2 U$3.16(IN3B)
BUMPER_BACK_RIGHT_A: SENSOR_BACK_RIGHT.1 U$3.13(IN2A)
BUMPER_BACK_RIGHT_B: SENSOR_BACK_RIGHT.2 U$3.14(IN2B)
BUMPER_FRONT_LEFT_A: SENSOR_FRONT_LEFT.1 U$3.11(IN1A)
BUMPER_FRONT_LEFT_B: SENSOR_FRONT_LEFT.2 U$3.12(IN1B)
BUMPER_FRONT_RIGHT_A: SENSOR_FRONT_RIGHT.2 U$3.9(IN0A)
BUMPER_FRONT_RIGHT_B: SENSOR_FRONT_RIGHT.1 U$3.10(IN0B)
ENCODER_LEFT_A: ENCODER_LEFT.7 ; also sheet 1
ENCODER_LEFT_B: ENCODER_LEFT.5 ; also sheet 1
ENCODER_RIGHT_A: ENCODER_RIGHT.7 ; also sheet 1
ENCODER_RIGHT_B: ENCODER_RIGHT.5 ; also sheet 1
ENCODER_SPI_CLK: ENCODER_LEFT.2 ENCODER_RIGHT.2 U$4.23(SCL/SCLK) ; also sheet 1
ENCODER_SPI_CS-N_L: ENCODER_LEFT.8 ; also sheet 1
ENCODER_SPI_CS-N_R: ENCODER_RIGHT.8 ; also sheet 1
ENCODER_SPI_MISO: ENCODER_LEFT.4 ENCODER_RIGHT.4 U$4.9(ADO/SDO) ; also sheet 1
ENCODER_SPI_MOSI: ENCODER_LEFT.6 ENCODER_RIGHT.6 U$4.24(SDA/SDI) ; also sheet 1
GND: C46.2 C47.2 C57.1 C58.2 C59.1 ENCODER_LEFT.1 ENCODER_RIGHT.1 LDC_I2C1.5 LDC_I2C1.6 SENSOR_I2C.2 U$3.4(ADDR) U$3.8(GND) U$4.18(GND) U$4.20(RESV2) U$4.25(PAD) ; also sheet 1,2,3,5,6,7,8,9
IMU_CS: R141.1 U$4.22(NCS) ; also sheet 1
IMU_FSYNC: IMU_FSYNC.1 U$4.11(FSYNC)
IMU_INT: R47.2 U$4.12(INT) ; also sheet 1
LDC_CLKIN: U$3.3(CLKIN) ; also sheet 1
LDC_INTERRUPT: R52.2 U$3.5(INTB) ; also sheet 1
LDC_PWR: C46.1 C47.1 L1.2 R117.1 U$3.7(VDD)
LDC_SCL: LDC_I2C1.3 LDC_I2C1.4 R2.1 U$3.1(SCL) ; also sheet 1
LDC_SDA: LDC_I2C1.1 LDC_I2C1.2 R1.1 U$3.2(SDA) ; also sheet 1
LDC_SHUTDOWN: R117.2 U$3.6(SD) ; also sheet 1
N$22: LED47.C R47.1
N$23: LED48.C R52.1
NC_IMU_1: NC59.NC U$4.2(NC1)
NC_IMU_2: NC4.NC U$4.3(NC2)
NC_IMU_3: NC3.NC U$4.4(NC3)
NC_IMU_4: NC2.NC U$4.5(NC4)
NC_IMU_5: NC60.NC U$4.6(NC5)
NC_IMU_6: NC61.NC U$4.14(NC6)
NC_IMU_7: NC62.NC U$4.15(NC7)
NC_IMU_8: NC63.NC U$4.16(NC8)
NC_IMU_9: NC64.NC U$4.17(NC9)
NC_IMU_RESV1: NC1.NC U$4.19(RESV1)
REGOUT: C57.2 U$4.10(REGOUT)
SENSOR_I2C_SCL: R169.1 SENSOR_I2C.4 U$4.7(AUX_CL)
SENSOR_I2C_SDA: R170.2 SENSOR_I2C.3 U$4.21(AUX_DA)

### Notes on the sheet
- Place as far ad possible from the motors and other iron staff (like a display frame).
  And keep away all high current path and bumper sensing coils.

## Sheet 5 of 9: COMMUNICATION
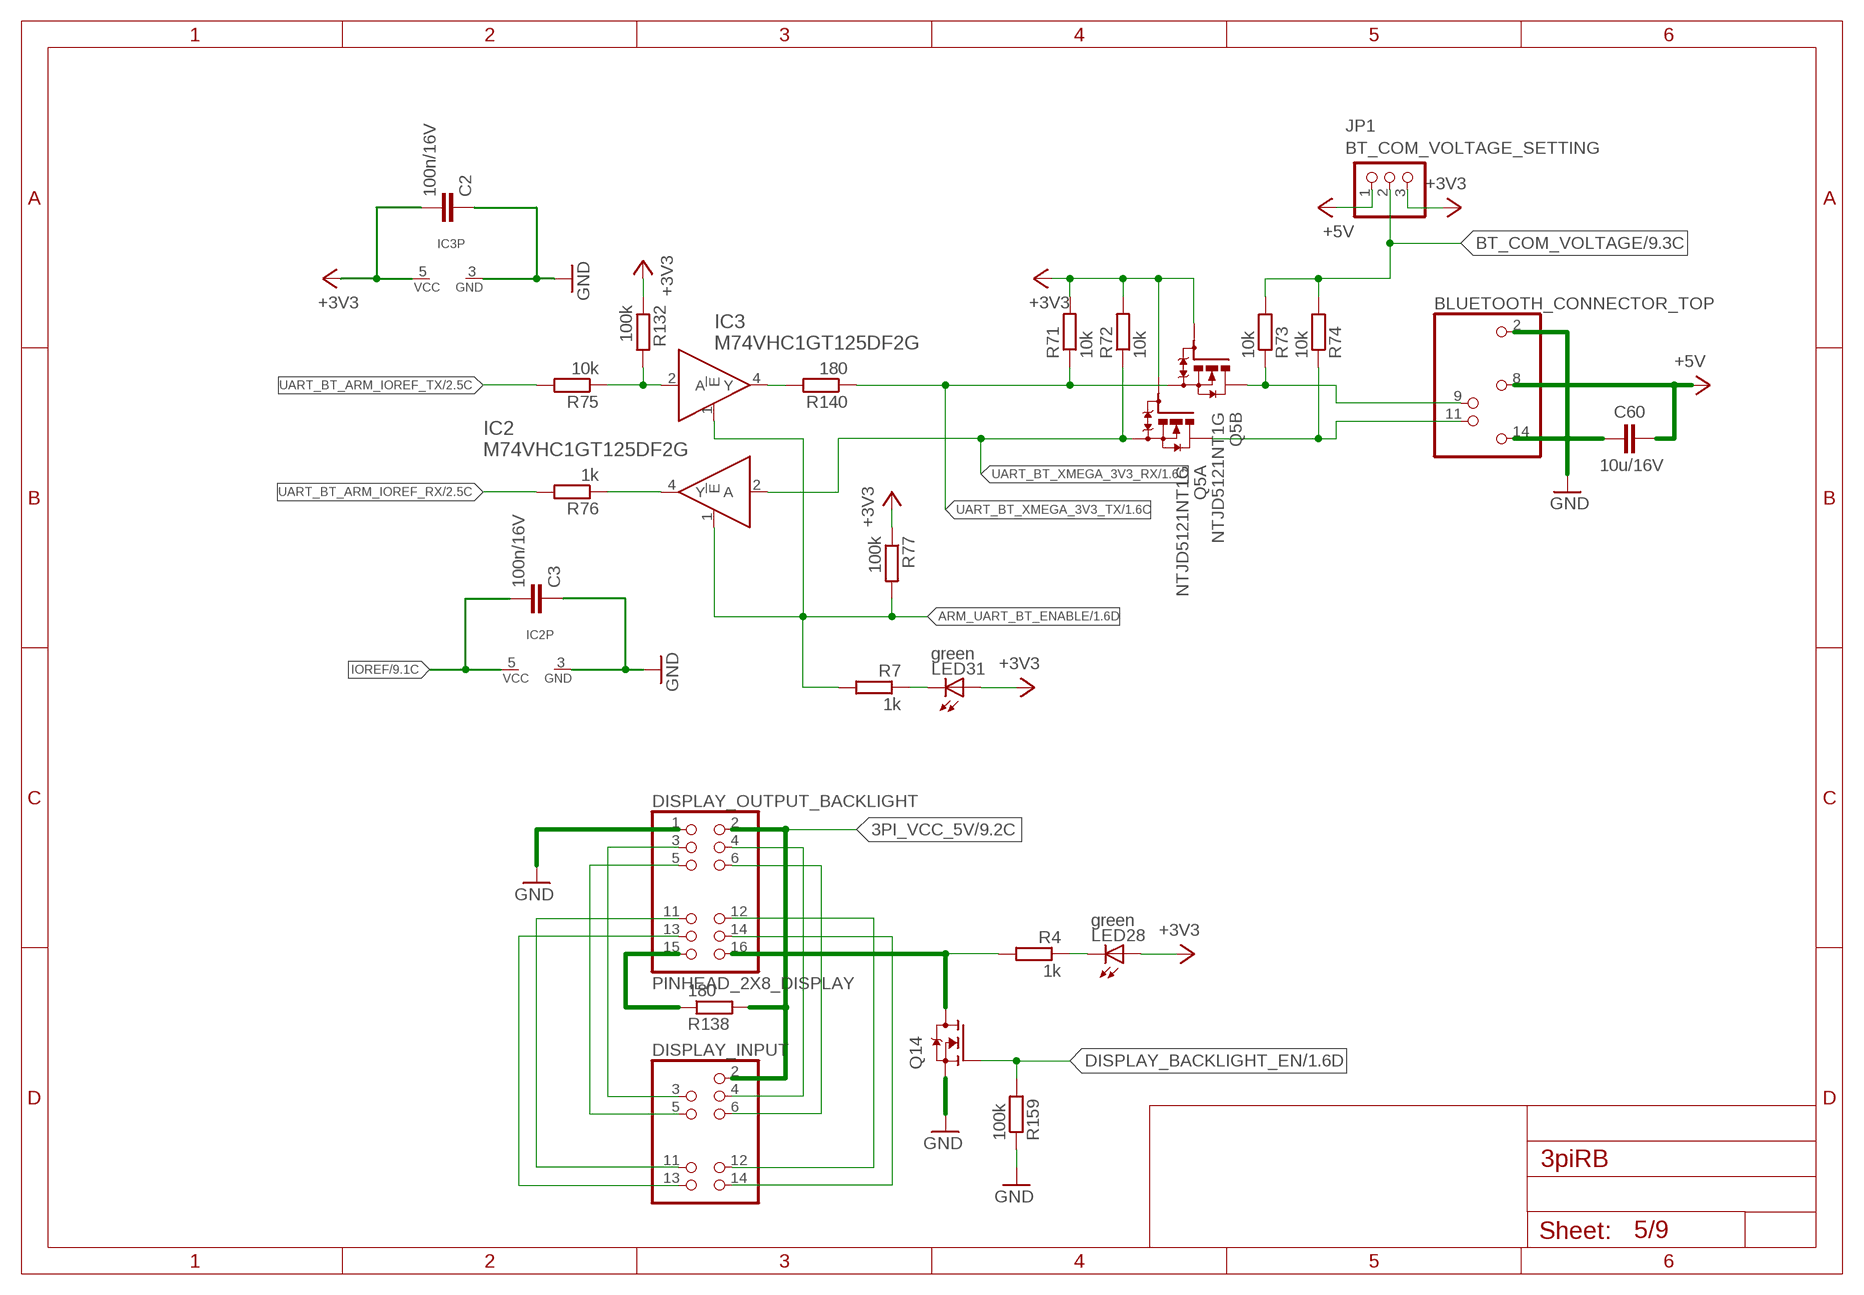
[diagram p8: schematic, sheet 5]

### Parts
BLUETOOTH_CONNECTOR_TOP  BLUETOOTH_CONNECTOR_TOP  [BLUETOOTH_CONNECTOR_TOP]
C2  100n/16V  C-EUC0402  [C0402]
C3  100n/16V  C-EUC0402  [C0402]
C60  10u/16V  C-EUC0805  [C0805]
DISPLAY_INPUT  DISPLAY_INPUT  [DISPLAY_INPUT]
DISPLAY_OUTPUT_BACKLIGHT  PINHEAD_2X8_DISPLAY  [PINHEAD_2X8_DISPLAY]
IC2  M74VHC1GT125DF2G  741G125  [SOT353]
IC3  M74VHC1GT125DF2G  741G125  [SOT353]
JP1  BT_COM_VOLTAGE_SETTING  PINHD-1X3  [1X03]
LED28  green  LEDCHIPLED_0603  [CHIPLED_0603]
LED31  green  LEDCHIPLED_0603  [CHIPLED_0603]
Q5  NTJD5121NT1G  [SOT363]
Q14  N-MOSFET-SOT323-GSD  [SOT323]
R4  1k  RESISTOR_0402MP  [_0402MP]
R7  1k  RESISTOR_0402MP  [_0402MP]
R71  10k  RESISTOR_0402MP  [_0402MP]
R72  10k  RESISTOR_0402MP  [_0402MP]
R73  10k  RESISTOR_0402MP  [_0402MP]
R74  10k  RESISTOR_0402MP  [_0402MP]
R75  10k  RESISTOR_0402MP  [_0402MP]
R76  1k  RESISTOR_0402MP  [_0402MP]
R77  100k  RESISTOR_0402MP  [_0402MP]
R132  100k  RESISTOR_0402MP  [_0402MP]
R138  180  RESISTOR_0402MP  [_0402MP]
R140  180  RESISTOR_0402MP  [_0402MP]
R159  100k  RESISTOR_0402MP  [_0402MP]

### Nets
3PI_VCC_5V: DISPLAY_INPUT.2 DISPLAY_OUTPUT_BACKLIGHT.2 R138.2 ; also sheet 9
+3V3: C2.2 IC3.5(VCC) JP1.3 LED28.A LED31.A Q5.2(A:G) Q5.5(B:G) R71.2 R72.2 R77.1 R132.1 ; also sheet 1,4,6,7,8,9
+5V: BLUETOOTH_CONNECTOR_TOP.8 C60.2 JP1.1 ; also sheet 1,2,3,7,8,9
ARM_UART_BT_ENABLE: IC2.1(!E) IC3.1(!E) R7.2 R77.2 ; also sheet 1
BT_COM_VOLTAGE: JP1.2 R73.2 R74.2 ; also sheet 9
DISPLAY_BACKLIGHT_EN: Q14.1(G) R159.2 ; also sheet 1
DISPLAY_BACKLIGHT_SW_GND: DISPLAY_OUTPUT_BACKLIGHT.16 Q14.3(D) R4.2
DISPLAY_BACKLIGHT_VCC: DISPLAY_OUTPUT_BACKLIGHT.15 R138.1
DISPLAY_DB4: DISPLAY_INPUT.11 DISPLAY_OUTPUT_BACKLIGHT.11
DISPLAY_DB5: DISPLAY_INPUT.12 DISPLAY_OUTPUT_BACKLIGHT.12
DISPLAY_DB6: DISPLAY_INPUT.13 DISPLAY_OUTPUT_BACKLIGHT.13
DISPLAY_DB7: DISPLAY_INPUT.14 DISPLAY_OUTPUT_BACKLIGHT.14
DISPLAY_E: DISPLAY_INPUT.6 DISPLAY_OUTPUT_BACKLIGHT.6
DISPLAY_R!W: DISPLAY_INPUT.5 DISPLAY_OUTPUT_BACKLIGHT.5
DISPLAY_RS: DISPLAY_INPUT.4 DISPLAY_OUTPUT_BACKLIGHT.4
DISPLAY_V0: DISPLAY_INPUT.3 DISPLAY_OUTPUT_BACKLIGHT.3
GND: BLUETOOTH_CONNECTOR_TOP.2 BLUETOOTH_CONNECTOR_TOP.14 C2.1 C3.1 C60.1 DISPLAY_OUTPUT_BACKLIGHT.1 IC2.3(GND) IC3.3(GND) Q14.2(S) R159.1 ; also sheet 1,2,3,4,6,7,8,9
IOREF: C3.2 IC2.5(VCC) ; also sheet 1,2,9
N$4: LED28.C R4.1
N$7: LED31.C R7.1
UART_BT_5V_RX1: BLUETOOTH_CONNECTOR_TOP.11 Q5.6(A:D) R74.1
UART_BT_5V_TX1: BLUETOOTH_CONNECTOR_TOP.9 Q5.3(B:D) R73.1
UART_BT_ARM_IOREF-RX: IC2.4(Y) R76.1
UART_BT_ARM_IOREF-TX: IC3.2(A) R75.1 R132.2
UART_BT_ARM_IOREF_RX: R76.2 ; also sheet 2
UART_BT_ARM_IOREF_TX: R75.2 ; also sheet 2
UART_BT_XMEGA_3V3-TX: IC3.4(Y) R140.2
UART_BT_XMEGA_3V3_RX: IC2.2(A) Q5.1(A:S) R72.1 ; also sheet 1
UART_BT_XMEGA_3V3_TX: Q5.4(B:S) R71.1 R140.1 ; also sheet 1

## Sheet 6 of 9: POWER
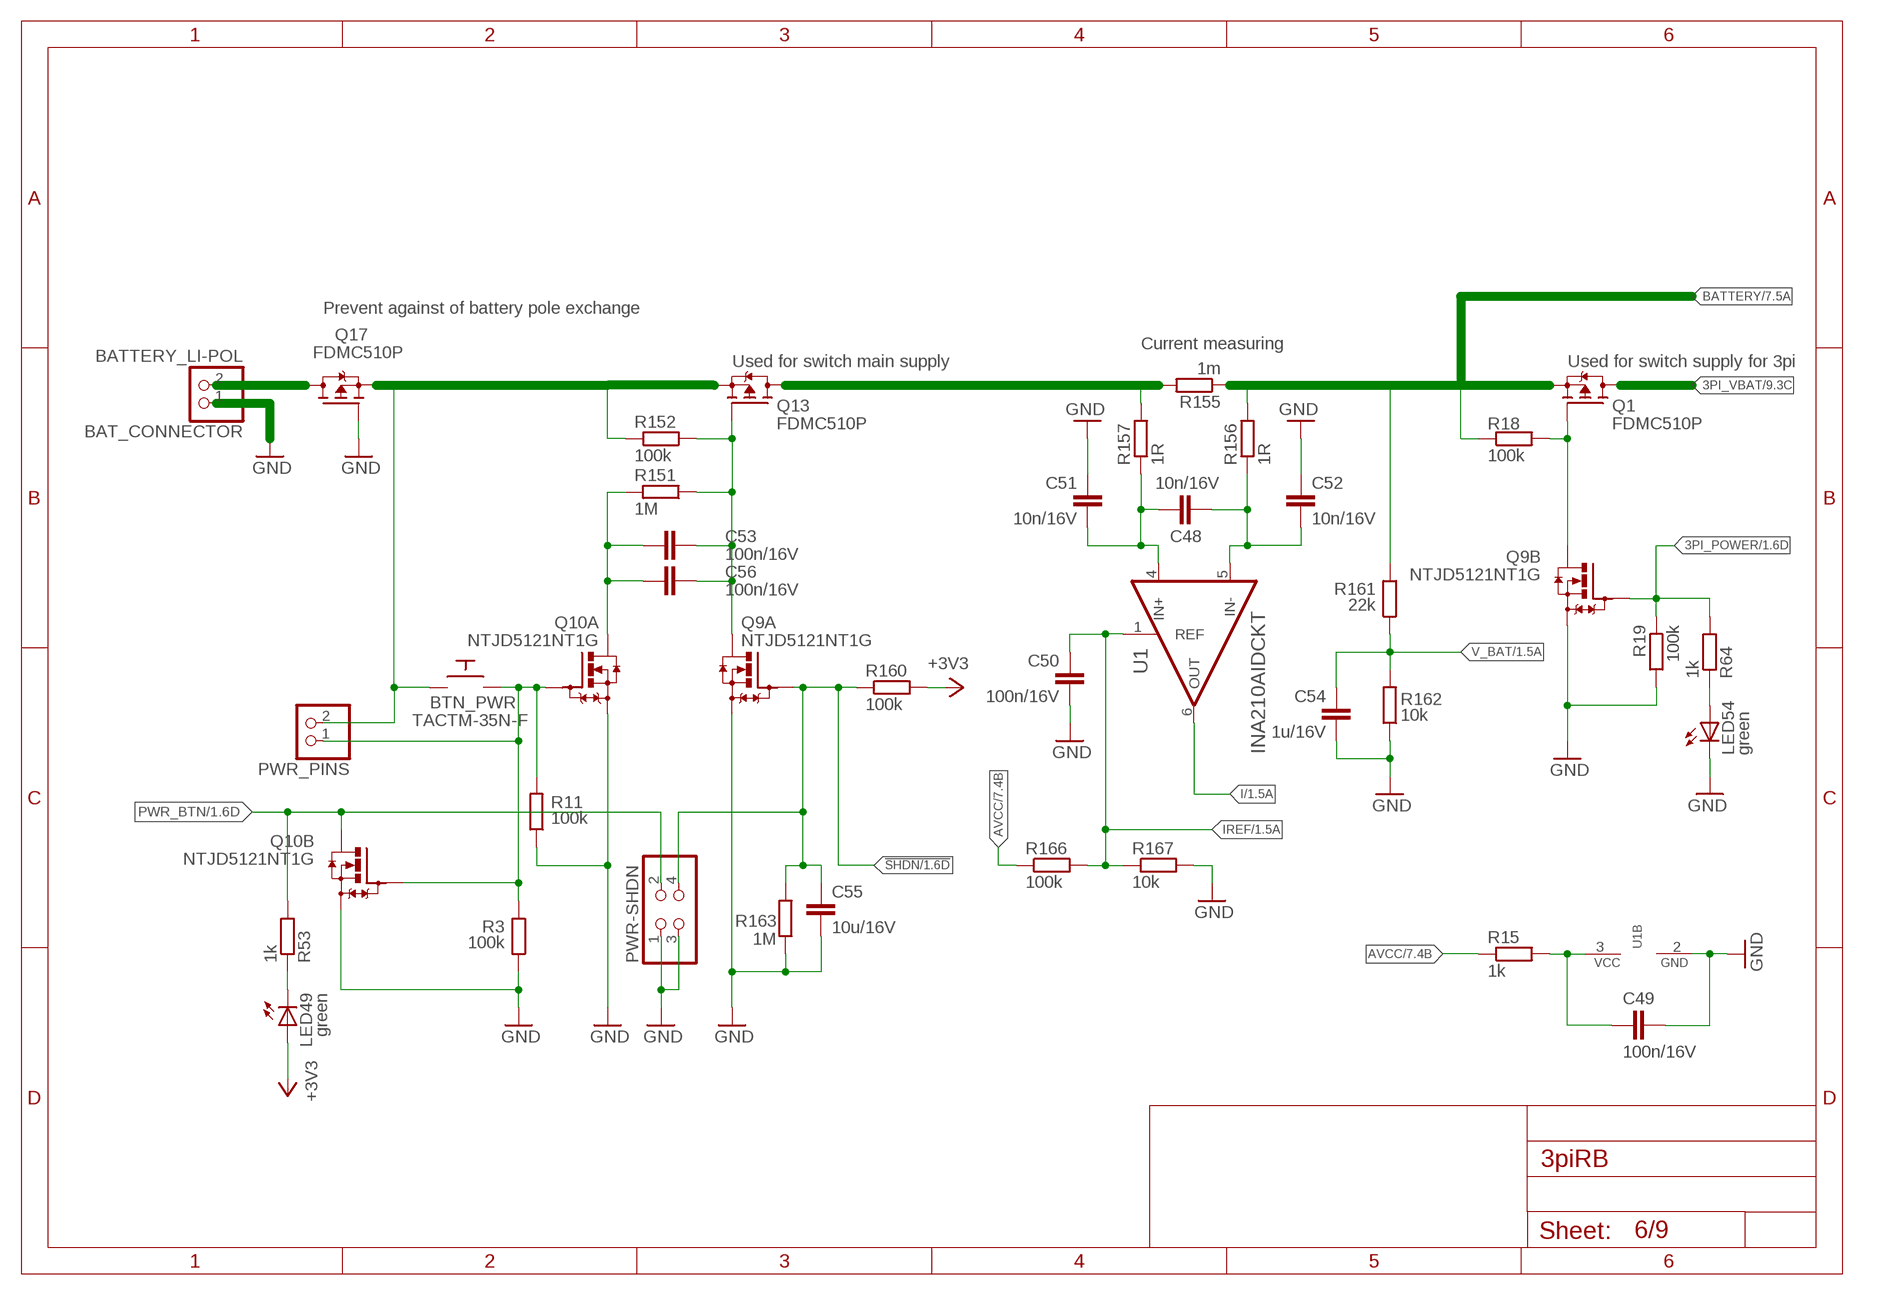
[diagram p9: schematic, sheet 6]

### Parts
BAT_CONNECTOR  BATTERY_LI-POL  PINHD-1X2  [1X02]
BTN_PWR  TACTM-35N-F  [TACTM-35N-F]
C48  10n/16V  C-EUC0402  [C0402]
C49  100n/16V  C-EUC0402  [C0402]
C50  100n/16V  C-EUC0402  [C0402]
C51  10n/16V  C-EUC0402  [C0402]
C52  10n/16V  C-EUC0402  [C0402]
C53  100n/16V  C-EUC0402  [C0402]
C54  1u/16V  C-EUC0805  [C0805]
C55  10u/16V  C-EUC0805  [C0805]
C56  100n/16V  C-EUC0402  [C0402]
LED49  green  LEDCHIPLED_0603  [CHIPLED_0603]
LED54  green  LEDCHIPLED_0603  [CHIPLED_0603]
PWR-SHDN  PINHD-2X2  [2X02]
PWR_PINS  PINHD-1X2  [1X02]
Q1  FDMC510P  P-MOSFET-MLP_HS  [MLP3.3X3.3_HS]
Q9  NTJD5121NT1G  [SOT363]
Q10  NTJD5121NT1G  [SOT363]
Q13  FDMC510P  P-MOSFET-MLP_HS  [MLP3.3X3.3_HS]
Q17  FDMC510P  P-MOSFET-MLP_HS  [MLP3.3X3.3_HS]
R3  100k  RESISTOR_0402MP  [_0402MP]
R11  100k  RESISTOR_0402MP  [_0402MP]
R15  1k  RESISTOR_0402MP  [_0402MP]
R18  100k  RESISTOR_0402MP  [_0402MP]
R19  100k  RESISTOR_0402MP  [_0402MP]
R53  1k  RESISTOR_0402MP  [_0402MP]
R64  1k  RESISTOR_0402MP  [_0402MP]
R151  1M  RESISTOR_0402MP  [_0402MP]
R152  100k  RESISTOR_0402MP  [_0402MP]
R155  1m  RESISTOR1206  [1206]
R156  1R  RESISTOR_0402MP  [_0402MP]
R157  1R  RESISTOR_0402MP  [_0402MP]
R160  100k  RESISTOR_0402MP  [_0402MP]
R161  22k  RESISTOR_0402MP  [_0402MP]
R162  10k  RESISTOR_0402MP  [_0402MP]
R163  1M  RESISTOR_0402MP  [_0402MP]
R166  100k  RESISTOR_0402MP  [_0402MP]
R167  10k  RESISTOR_0402MP  [_0402MP]
U1  INA210AIDCKT  INA213AIDCKT  [SOT65P210X110-6N]

### Nets
3_PI_POWER_H_GATE: Q1.4(G) Q9.3(B:D) R18.2
3PI_POWER: Q9.5(B:G) R19.1 R64.2 ; also sheet 1
3PI_VBAT: Q1.5(D) Q1.6(D) Q1.7(D) Q1.8(D) ; also sheet 1,9
!SHDN: C55.2 PWR-SHDN.4 Q9.2(A:G) R160.1 R163.2 ; also sheet 1
+3V3: LED49.A R160.2 ; also sheet 1,4,5,7,8,9
AVCC: R15.1 R166.1 ; also sheet 1,7,8
BATTERY: Q1.1(S) Q1.2(S) Q1.3(S) R18.1 R155.1 R156.2 R161.2 ; also sheet 7,8,9
BATTERY_BEHIND_SWITCH: Q13.5(D) Q13.6(D) Q13.7(D) Q13.8(D) R155.2 R157.2
BATTERY_CONNECTOR: BAT_CONNECTOR.2 Q17.5(D) Q17.6(D) Q17.7(D) Q17.8(D)
BATTERY_REVERSE_PROTECTED: BTN_PWR.P$4 PWR_PINS.2 Q13.1(S) Q13.2(S) Q13.3(S) Q17.1(S) Q17.2(S) Q17.3(S) R152.2
BTN_PWR_: BTN_PWR.P$2 PWR_PINS.1 Q10.2(A:G) Q10.5(B:G) R3.2 R11.2
GND: BAT_CONNECTOR.1 C49.1 C50.1 C51.2 C52.2 C54.2 C55.1 LED54.C PWR-SHDN.1 PWR-SHDN.3 Q9.1(A:S) Q9.4(B:S) Q10.1(A:S) Q10.4(B:S) Q17.4(G) R3.1 R11.1 R19.2 R162.1 R163.1 R167.2 U1.2(GND) ; also sheet 1,2,3,4,5,7,8,9
I: U1.6(OUT) ; also sheet 1
I_AMP_PWR: C49.2 R15.2 U1.3(VCC)
I_IN+: C48.1 C51.1 R157.1 U1.4(IN+)
I_IN-: C48.2 C52.1 R156.1 U1.5(IN-)
IREF: C50.2 R166.2 R167.1 U1.1(REF) ; also sheet 1
LED_R_25: LED54.A R64.1
N$24: LED49.C R53.1
ON_SW: C53.2 C56.2 Q10.6(A:D) R151.2
PWR_BTN: PWR-SHDN.2 Q10.3(B:D) R53.2 ; also sheet 1
SW_GATE: C53.1 C56.1 Q9.6(A:D) Q13.4(G) R151.1 R152.1
V_BAT: C54.1 R161.1 R162.2 ; also sheet 1

### Notes on the sheet
- Prevent against of battery pole exchange
- Current measuring
- Used for switch main supply | Used for switch supply for 3pi

## Sheet 7 of 9: CHARGING
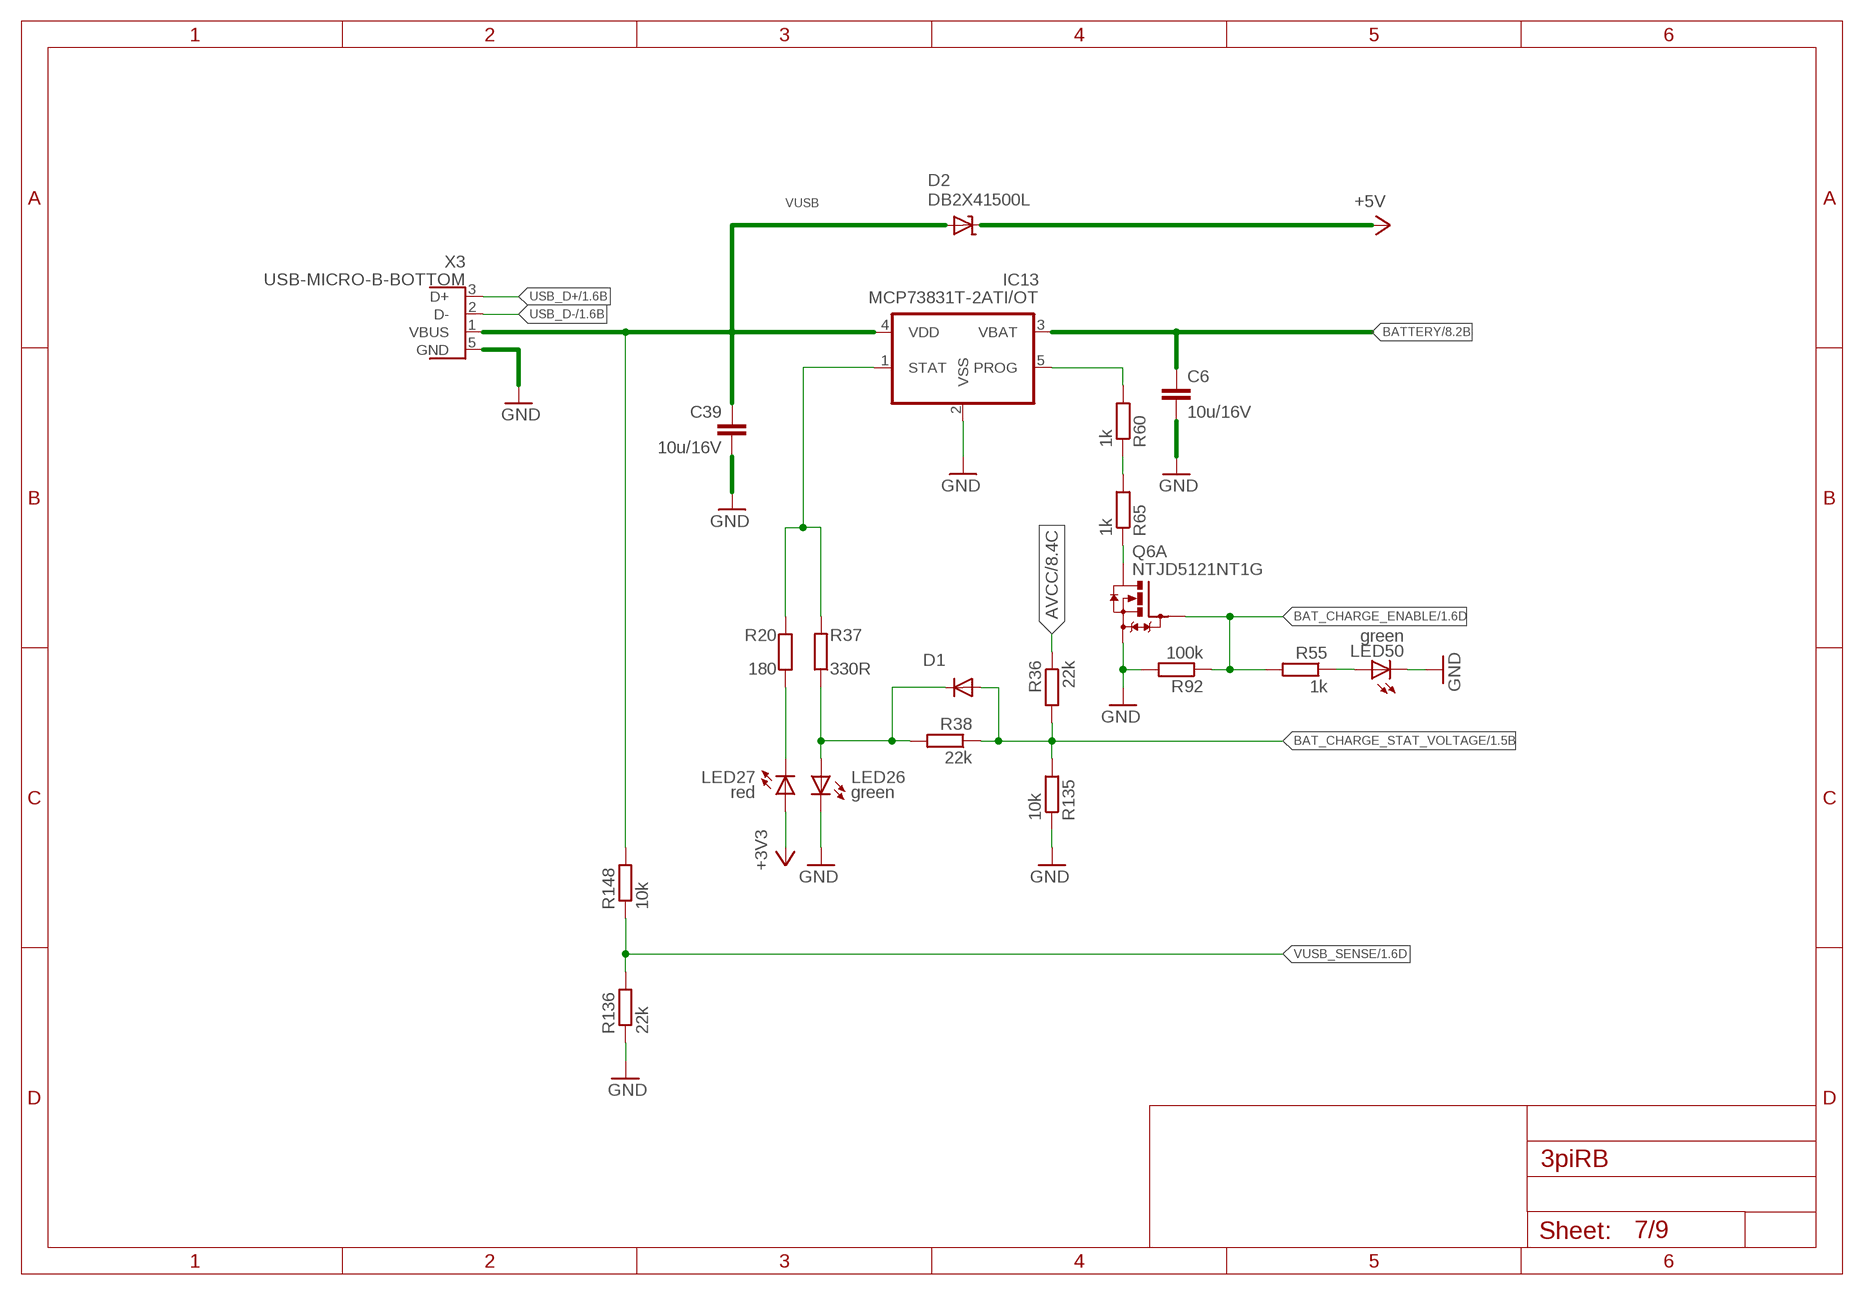
[diagram p10: schematic, sheet 7]

### Parts
C6  10u/16V  C-EUC0805  [C0805]
C39  10u/16V  C-EUC0805  [C0805]
D1  DIODE-0603  [D0603]
D2  DB2X41500L  SHOTTKY-SOD123  [SOD123]
IC13  MCP73831T-2ATI/OT  [SOT95P300X145-5N]
LED26  green  LEDCHIPLED_0603  [CHIPLED_0603]
LED27  red  LEDCHIPLED_0603  [CHIPLED_0603]
LED50  green  LEDCHIPLED_0603  [CHIPLED_0603]
Q6  NTJD5121NT1G  [SOT363]
R20  180  RESISTOR_0402MP  [_0402MP]
R36  22k  RESISTOR_0402MP  [_0402MP]
R37  330R  RESISTOR_0402MP  [_0402MP]
R38  22k  RESISTOR_0402MP  [_0402MP]
R55  1k  RESISTOR_0402MP  [_0402MP]
R60  1k  RESISTOR_0402MP  [_0402MP]
R65  1k  RESISTOR_0402MP  [_0402MP]
R92  100k  RESISTOR_0402MP  [_0402MP]
R135  10k  RESISTOR_0402MP  [_0402MP]
R136  22k  RESISTOR_0402MP  [_0402MP]
R148  10k  RESISTOR_0402MP  [_0402MP]
X3  USB-MICRO-B-BOTTOM  [USB-MICRO-B-BOTTOM-MOLEX]

### Nets
+3V3: LED27.A ; also sheet 1,4,5,6,8,9
+5V: D2.C ; also sheet 1,2,3,5,8,9
AVCC: R36.1 ; also sheet 1,6,8
BAT_CHARGE_ENABLE: Q6.2(A:G) R55.2 R92.1 ; also sheet 1
BAT_CHARGE_STAT_VOLTAGE: D1.A R36.2 R38.1 R135.2 ; also sheet 1
BATTERY: C6.1 IC13.3(VBAT) ; also sheet 6,8,9
GND: C6.2 C39.2 IC13.2(VSS) LED26.C LED50.C Q6.1(A:S) R92.2 R135.1 R136.1 X3.5(GND) ; also sheet 1,2,3,4,5,6,8,9
I_CHARGE_PROG-: IC13.5(PROG) R60.2
LED_R_21: LED50.A R55.1
N$2: IC13.1(STAT) R20.2 R37.2
N$3: D1.C LED26.A R37.1 R38.2
N$5: LED27.C R20.1
N$25: Q6.6(A:D) R65.1
N$26: R60.1 R65.2
USB_D+: X3.3(D+) ; also sheet 1
USB_D-: X3.2(D-) ; also sheet 1
VUSB: C39.1 D2.A IC13.4(VDD) R148.2 X3.1(VBUS) ; also sheet 9
VUSB_SENSE: R136.2 R148.1 ; also sheet 1

## Sheet 8 of 9: REGULATORS
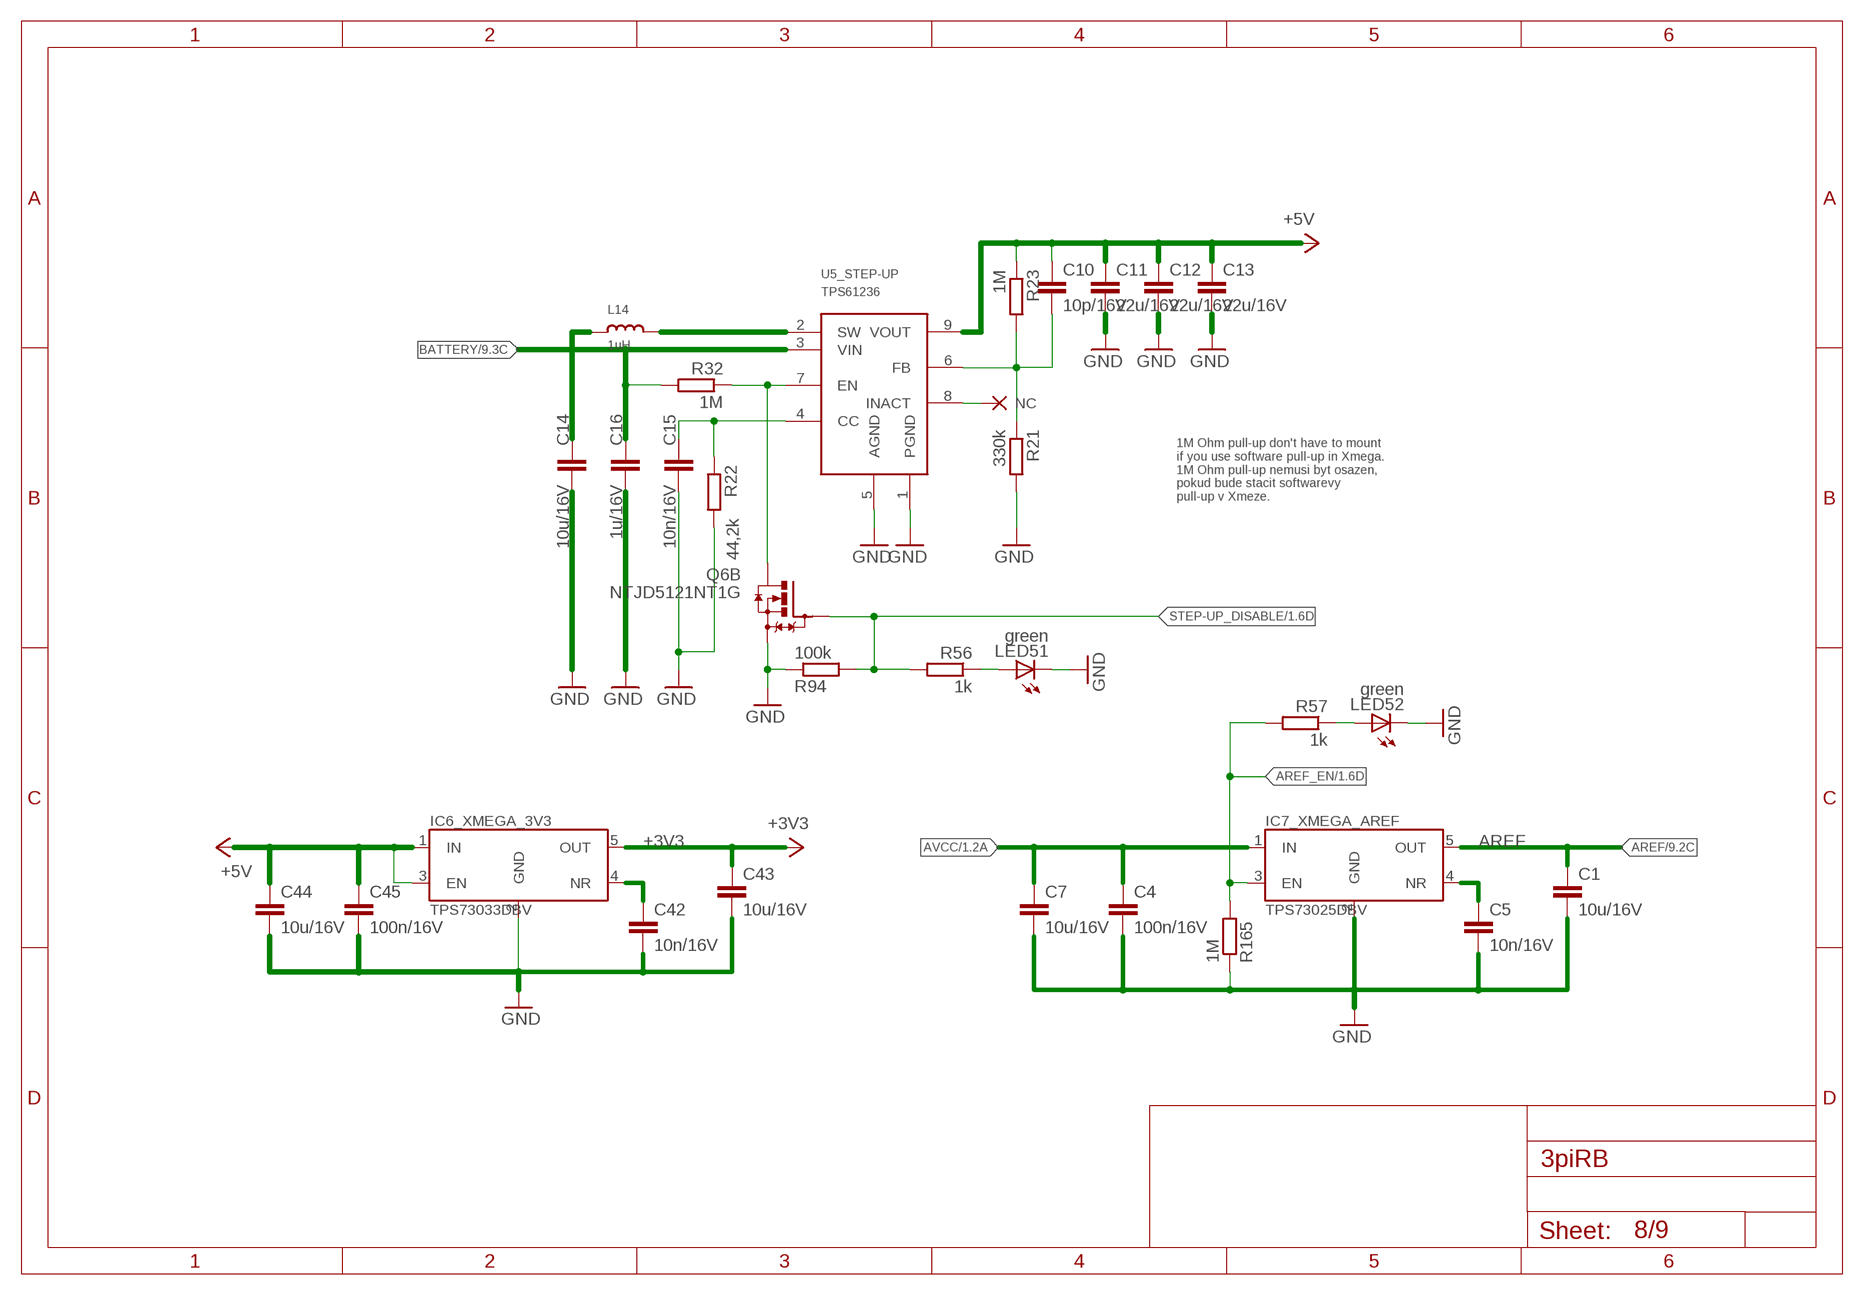
[diagram p11: schematic, sheet 8]

### Parts
C1  10u/16V  C-EUC0805  [C0805]
C4  100n/16V  C-EUC0402  [C0402]
C5  10n/16V  C-EUC0402  [C0402]
C7  10u/16V  C-EUC0805  [C0805]
C10  10p/16V  C-EUC0603  [C0603]
C11  22u/16V  C-EUC0805  [C0805]
C12  22u/16V  C-EUC0805  [C0805]
C13  22u/16V  C-EUC0805  [C0805]
C14  10u/16V  C-EUC0805  [C0805]
C15  10n/16V  C-EUC0402  [C0402]
C16  1u/16V  C-EUC0805  [C0805]
C42  10n/16V  C-EUC0402  [C0402]
C43  10u/16V  C-EUC0805  [C0805]
C44  10u/16V  C-EUC0805  [C0805]
C45  100n/16V  C-EUC0402  [C0402]
IC6_XMEGA_3V3  TPS73033DBV  [SOT23-DBV]
IC7_XMEGA_AREF  TPS73025DBV  TPS73033DBV  [SOT23-DBV]
L14  1uH  XAL7030  [XAL7030]
LED51  green  LEDCHIPLED_0603  [CHIPLED_0603]
LED52  green  LEDCHIPLED_0603  [CHIPLED_0603]
NC65  NC  (no package)
R21  330k  RESISTOR_0402MP  [_0402MP]
R22  44,2k  RESISTOR_0402MP  [_0402MP]
R23  1M  RESISTOR_0402MP  [_0402MP]
R32  1M  RESISTOR_0402MP  [_0402MP]
R56  1k  RESISTOR_0402MP  [_0402MP]
R57  1k  RESISTOR_0402MP  [_0402MP]
R94  100k  RESISTOR_0402MP  [_0402MP]
R165  1M  RESISTOR_0402MP  [_0402MP]
U5_STEP-UP  TPS61236  [VQFN]

### Nets
+3V3: C43.1 IC6_XMEGA_3V3.5(OUT) ; also sheet 1,4,5,6,7,9
+5V: C10.1 C11.1 C12.1 C13.1 C44.1 C45.1 IC6_XMEGA_3V3.1(IN) IC6_XMEGA_3V3.3(EN) R23.1 U5_STEP-UP.9(VOUT) ; also sheet 1,2,3,5,7,9
AREF: C1.1 IC7_XMEGA_AREF.5(OUT) ; also sheet 1,3,9
AREF_EN: IC7_XMEGA_AREF.3(EN) R57.2 R165.2 ; also sheet 1
AVCC: C4.1 C7.1 IC7_XMEGA_AREF.1(IN) ; also sheet 1,6,7
BATTERY: C14.1 C16.1 L14.1 R32.2 U5_STEP-UP.3(VIN) ; also sheet 6,7,9
GND: C1.2 C4.2 C5.2 C7.2 C11.2 C12.2 C13.2 C14.2 C15.2 C16.2 C42.2 C43.2 C44.2 C45.2 IC6_XMEGA_3V3.2(GND) IC7_XMEGA_AREF.2(GND) LED51.C LED52.C Q6.4(B:S) R21.2 R22.2 R94.1 R165.1 U5_STEP-UP.1(PGND) U5_STEP-UP.5(AGND) ; also sheet 1,2,3,4,5,6,7,9
LED_R_22: LED51.A R56.1
LED_R_23: LED52.A R57.1
NC_STEP-UP_INACT: NC65.NC U5_STEP-UP.8(INACT)
STAB_2V5_NR: C5.1 IC7_XMEGA_AREF.4(NR)
STAB_3V3_NR: C42.1 IC6_XMEGA_3V3.4(NR)
STEP-UP_DISABLE: Q6.5(B:G) R56.2 R94.2 ; also sheet 1
STEP-UP_ENABLE: Q6.3(B:D) R32.1 U5_STEP-UP.7(EN)
STEP_UP_CC: C15.1 R22.1 U5_STEP-UP.4(CC)
STEP_UP_FB: C10.2 R21.1 R23.2 U5_STEP-UP.6(FB)
STEP_UP_SW: L14.2 U5_STEP-UP.2(SW)

### Notes on the sheet
- 1M Ohm pull-up don't have to mount
  if you use software pull-up in Xmega.
  1M Ohm pull-up nemusi byt osazen, 
  pokud bude stacit softwarevy 
  pull-up v Xmeze.

## Sheet 9 of 9: LEDS
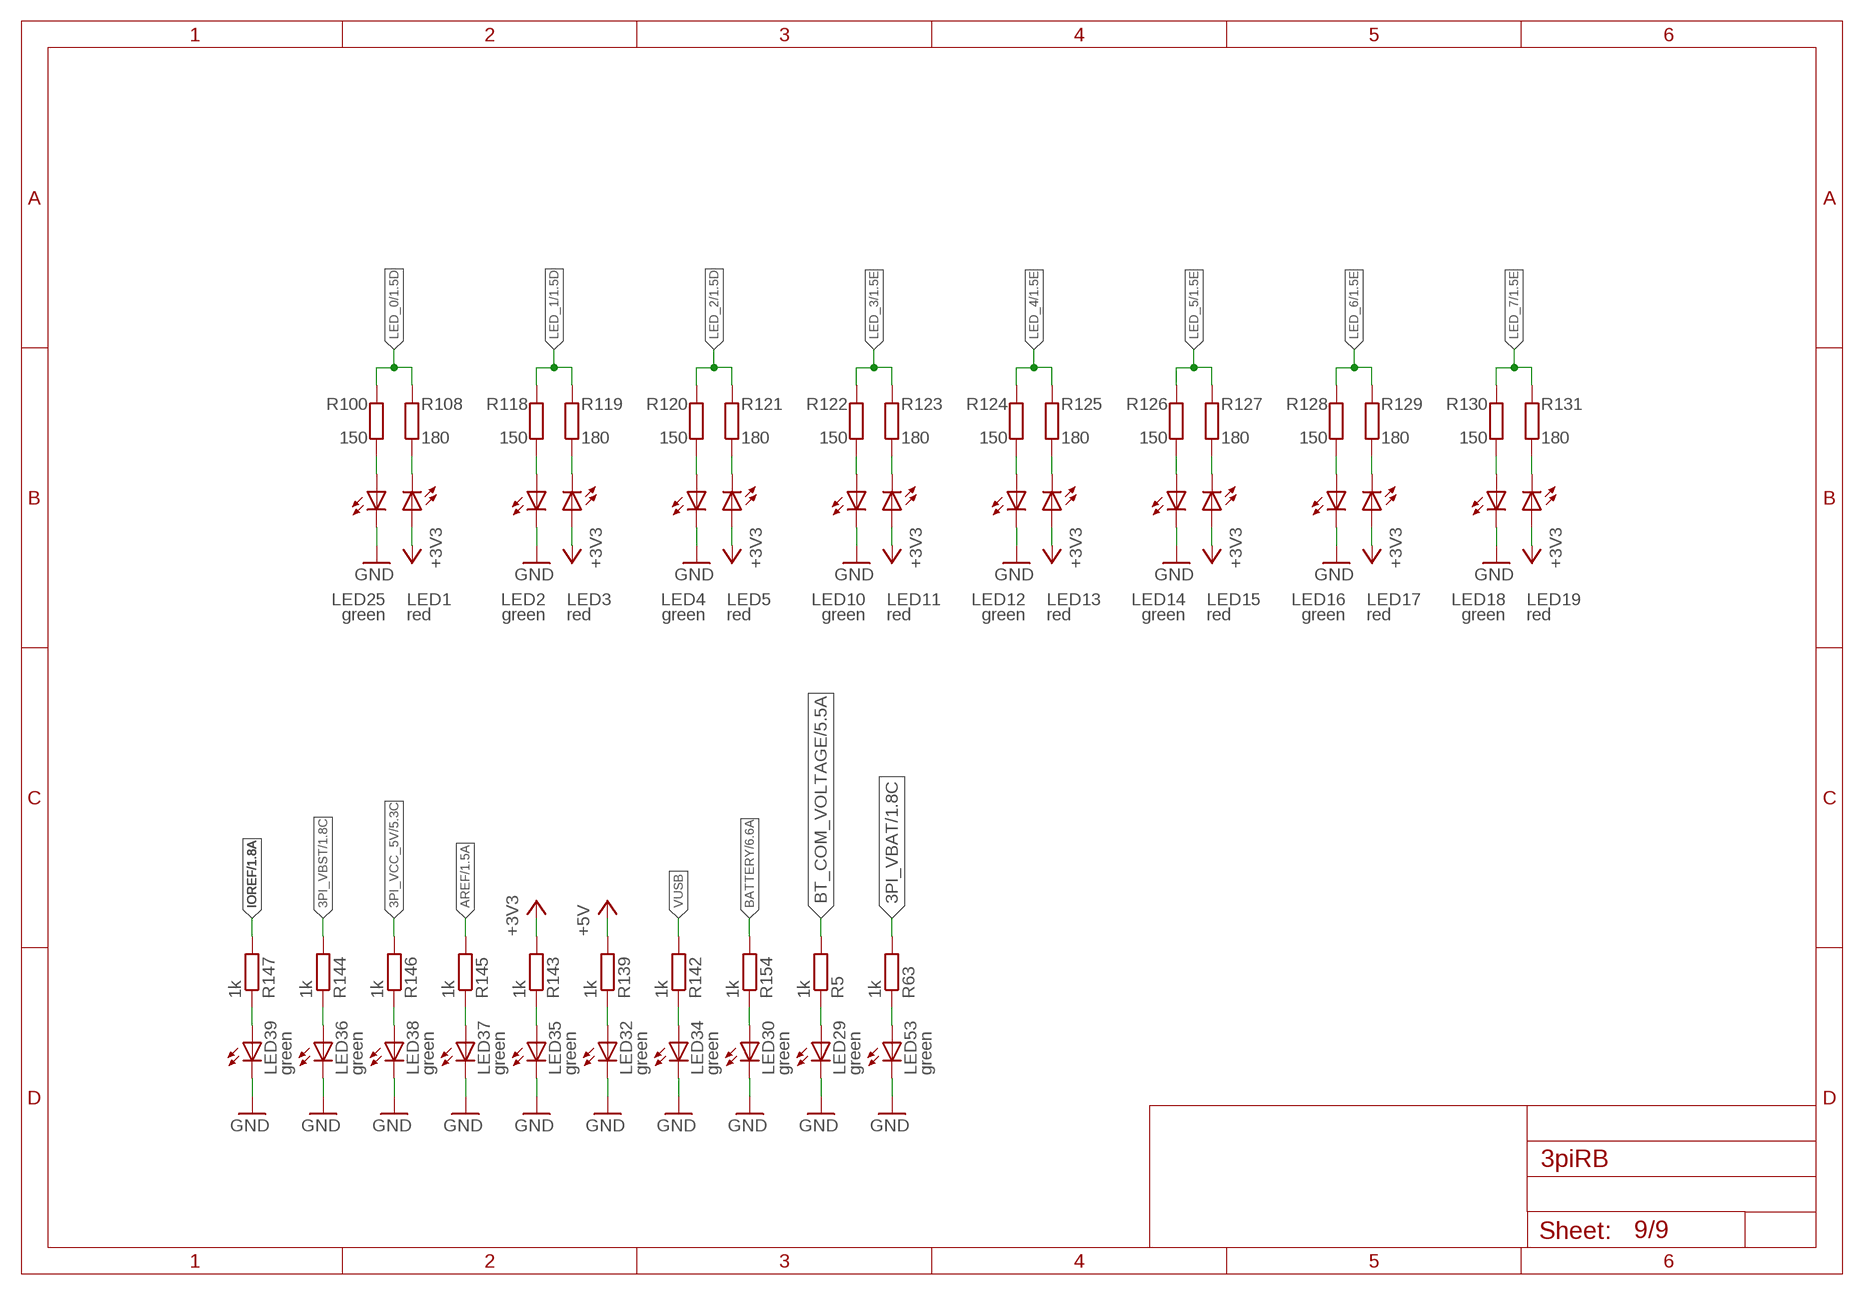
[diagram p12: schematic, sheet 9]

### Parts
LED1  red  LEDCHIPLED_0603  [CHIPLED_0603]
LED2  green  LEDCHIPLED_0603  [CHIPLED_0603]
LED3  red  LEDCHIPLED_0603  [CHIPLED_0603]
LED4  green  LEDCHIPLED_0603  [CHIPLED_0603]
LED5  red  LEDCHIPLED_0603  [CHIPLED_0603]
LED10  green  LEDCHIPLED_0603  [CHIPLED_0603]
LED11  red  LEDCHIPLED_0603  [CHIPLED_0603]
LED12  green  LEDCHIPLED_0603  [CHIPLED_0603]
LED13  red  LEDCHIPLED_0603  [CHIPLED_0603]
LED14  green  LEDCHIPLED_0603  [CHIPLED_0603]
LED15  red  LEDCHIPLED_0603  [CHIPLED_0603]
LED16  green  LEDCHIPLED_0603  [CHIPLED_0603]
LED17  red  LEDCHIPLED_0603  [CHIPLED_0603]
LED18  green  LEDCHIPLED_0603  [CHIPLED_0603]
LED19  red  LEDCHIPLED_0603  [CHIPLED_0603]
LED25  green  LEDCHIPLED_0603  [CHIPLED_0603]
LED29  green  LEDCHIPLED_0603  [CHIPLED_0603]
LED30  green  LEDCHIPLED_0603  [CHIPLED_0603]
LED32  green  LEDCHIPLED_0603  [CHIPLED_0603]
LED34  green  LEDCHIPLED_0603  [CHIPLED_0603]
LED35  green  LEDCHIPLED_0603  [CHIPLED_0603]
LED36  green  LEDCHIPLED_0603  [CHIPLED_0603]
LED37  green  LEDCHIPLED_0603  [CHIPLED_0603]
LED38  green  LEDCHIPLED_0603  [CHIPLED_0603]
LED39  green  LEDCHIPLED_0603  [CHIPLED_0603]
LED53  green  LEDCHIPLED_0603  [CHIPLED_0603]
R5  1k  RESISTOR_0402MP  [_0402MP]
R63  1k  RESISTOR_0402MP  [_0402MP]
R100  150  RESISTOR_0402MP  [_0402MP]
R108  180  RESISTOR_0402MP  [_0402MP]
R118  150  RESISTOR_0402MP  [_0402MP]
R119  180  RESISTOR_0402MP  [_0402MP]
R120  150  RESISTOR_0402MP  [_0402MP]
R121  180  RESISTOR_0402MP  [_0402MP]
R122  150  RESISTOR_0402MP  [_0402MP]
R123  180  RESISTOR_0402MP  [_0402MP]
R124  150  RESISTOR_0402MP  [_0402MP]
R125  180  RESISTOR_0402MP  [_0402MP]
R126  150  RESISTOR_0402MP  [_0402MP]
R127  180  RESISTOR_0402MP  [_0402MP]
R128  150  RESISTOR_0402MP  [_0402MP]
R129  180  RESISTOR_0402MP  [_0402MP]
R130  150  RESISTOR_0402MP  [_0402MP]
R131  180  RESISTOR_0402MP  [_0402MP]
R139  1k  RESISTOR_0402MP  [_0402MP]
R142  1k  RESISTOR_0402MP  [_0402MP]
R143  1k  RESISTOR_0402MP  [_0402MP]
R144  1k  RESISTOR_0402MP  [_0402MP]
R145  1k  RESISTOR_0402MP  [_0402MP]
R146  1k  RESISTOR_0402MP  [_0402MP]
R147  1k  RESISTOR_0402MP  [_0402MP]
R154  1k  RESISTOR_0402MP  [_0402MP]

### Nets
3PI_VBAT: R63.2 ; also sheet 1,6
3PI_VBST: R144.2 ; also sheet 1
3PI_VCC_5V: R146.2 ; also sheet 5
+3V3: LED1.A LED3.A LED5.A LED11.A LED13.A LED15.A LED17.A LED19.A R143.2 ; also sheet 1,4,5,6,7,8
+5V: R139.2 ; also sheet 1,2,3,5,7,8
AREF: R145.2 ; also sheet 1,3,8
BATTERY: R154.2 ; also sheet 6,7,8
BT_COM_VOLTAGE: R5.2 ; also sheet 5
GND: LED2.C LED4.C LED10.C LED12.C LED14.C LED16.C LED18.C LED25.C LED29.C LED30.C LED32.C LED34.C LED35.C LED36.C LED37.C LED38.C LED39.C LED53.C ; also sheet 1,2,3,4,5,6,7,8
IOREF: R147.2 ; also sheet 1,2,5
LED_0: R100.2 R108.2 ; also sheet 1
LED_1: R118.2 R119.2 ; also sheet 1
LED_2: R120.2 R121.2 ; also sheet 1
LED_3: R122.2 R123.2 ; also sheet 1
LED_4: R124.2 R125.2 ; also sheet 1
LED_5: R126.2 R127.2 ; also sheet 1
LED_6: R128.2 R129.2 ; also sheet 1
LED_7: R130.2 R131.2 ; also sheet 1
LED_G_0: LED1.C R108.1
LED_G_1: LED3.C R119.1
LED_G_2: LED5.C R121.1
LED_G_3: LED11.C R123.1
LED_G_4: LED13.C R125.1
LED_G_5: LED15.C R127.1
LED_G_6: LED17.C R129.1
LED_G_7: LED19.C R131.1
LED_R_0: LED25.A R100.1
LED_R_1: LED2.A R118.1
LED_R_2: LED4.A R120.1
LED_R_3: LED10.A R122.1
LED_R_4: LED12.A R124.1
LED_R_5: LED14.A R126.1
LED_R_6: LED16.A R128.1
LED_R_7: LED18.A R130.1
LED_R_9: LED29.A R5.1
LED_R_10: LED30.A R154.1
LED_R_11: LED32.A R139.1
LED_R_13: LED34.A R142.1
LED_R_14: LED35.A R143.1
LED_R_15: LED36.A R144.1
LED_R_16: LED37.A R145.1
LED_R_17: LED38.A R146.1
LED_R_18: LED39.A R147.1
LED_R_24: LED53.A R63.1
VUSB: R142.2 ; also sheet 7

## Library data of the parts
3PI_CONNECTOR = 3PI_PINHEADS:3PI_BT_CONNECTOR
BAT_CONNECTOR PWR_PINS SENSOR_BACK_LEFT SENSOR_BACK_RIGHT SENSOR_FRONT_LEFT SENSOR_FRONT_RIGHT = pinhead:PINHD-1X2: PIN HEADER
BLUETOOTH_CONNECTOR_TOP = 3PI_PINHEADS:BLUETOOTH_CONNECTOR_TOP
BTN_A BTN_B BTN_C BTN_D BTN_PWR = TACTM-35N-F:TACTM-35N-F
C1 C4 C5 C7 C42-C45 = rcl:C-EU: CAPACITOR, European symbol
C2 C3 C6 C8-C10 C14-C41 C46-C69 = rcl_upravena:C-EU: CAPACITOR, European symbol
C11-C13 = rcl_upravena:C-EU: CAPACITOR, European symbol; FARNELL: 2611932
D1 = diode:DIODE: DIODE ultra fast-recovery rectifier
D2 D5-D7 = diode:SHOTTKY
DISPLAY_INPUT = 3PI_PINHEADS:DISPLAY_INPUT
DISPLAY_OUTPUT_BACKLIGHT = pinhead_2x8_display:PINHEAD_2X8_DISPLAY
ENCODER_LEFT ENCODER_RIGHT LDC_I2C1 SUPPLY_CONNECTOR_5V-3V3 = pinhead:PINHD-2X4: PIN HEADER
FERITE_BEAD = rcl:R-EU_: RESISTOR, European symbol
FOTOTR_3MM_01-FOTOTR_3MM_09 LED1-LED39 LED41-LED54 = led:LED: LED OSRAM: - CHIPLED LG R971, LG N971, LY N971, LG Q971, LY Q971, LO R971, LY R971 LH N974, LH R974 LS Q976, LO Q976, LY Q976 LO Q996 - Hyper CHIPLED LW Q18S LB Q993, LB Q99A, LB R99A - SideLED LS A670, LO A670, LY A670, LG A670, LP A670 LB A673, LV A673, LT A673, LW A673 LH A674 LY A675 LS A676, LA A676, LO A676, LY A676, LW A676 LS A679, LY A679, LG A679 - Hyper Micro SIDELED® LS Y876, LA Y876, LO Y876, LY Y876 LT Y87S - SmartLED LW L88C, LW L88S LB L89C, LB L89S, LG L890 LS L89K, LO L89K, LY L89K LS L896, LA L896, LO L896, LY L896 - TOPLED LS T670, LO T670, LY T670, LG T670, LP T670 LSG T670, LSP T670, LSY T670, LOP T670, LYG T670 LG T671, LOG T671, LSG T671 LB T673, LV T673, LT T673, LW T673 LH T674 LS T676, LA T676, LO T676, LY T676, LB T676, LH T676, LSB T676, LW T676 LB T67C, LV T67C, LT T67C, LS T67K, LO T67K, LY T67K, LW E67C LS E67B, LA E67B, LO E67B, LY E67B, LB E67C, LV E67C, LT E67C LW T67C LS T679, LY T679, LG T679 LS T770, LO T770, LY T770, LG T770, LP T770 LB T773, LV T773, LT T773, LW T773 LH T774 LS E675, LA E675, LY E675, LS T675 LS T776, LA T776, LO T776, LY T776, LB T776 LHGB T686 LT T68C, LB T68C - Hyper Mini TOPLED® LB M676 - Mini TOPLED Santana® LG M470 LS M47K, LO M47K, LY M47K Source: http://www.osram.convergy.de LUXEON: - LUMILED® LXK2-PW12-R00, LXK2-PW12-S00, LXK2-PW14-U00, LXK2-PW14-V00 LXK2-PM12-R00, LXK2-PM12-S00, LXK2-PM14-U00 LXK2-PE12-Q00, LXK2-PE12-R00, LXK2-PE12-S00, LXK2-PE14-T00, LXK2-PE14-U00 LXK2-PB12-K00, LXK2-PB12-L00, LXK2-PB12-M00, LXK2-PB14-N00, LXK2-PB14-P00, LXK2-PB14-Q00 LXK2-PR12-L00, LXK2-PR12-M00, LXK2-PR14-Q00, LXK2-PR14-R00 LXK2-PD12-Q00, LXK2-PD12-R00, LXK2-PD12-S00 LXK2-PH12-R00, LXK2-PH12-S00 LXK2-PL12-P00, LXK2-PL12-Q00, LXK2-PL12-R00 Source: www.luxeon.com KINGBRIGHT: KA-3528ASYC Source: www.kingbright.com
IC1-IC3 IC5 = 74ahct1g125:74*1G125; OC_FARNELL: 2534357RL
IC4 = xmega:AVR_XMEGA_A1_: Device for Atmel AVR XMEGA A1 Series
IC6_XMEGA_3V3 IC7_XMEGA_AREF = tps73033:TPS73033
IC13 = MCP73831T:MCP73831T-2ATI/OT: IC, BATT CHARGER, Li-Ion Li-Polymer, 500 mA; MPN: MCP73831T-2ATI/OT; OC_FARNELL: 1834890; OC_NEWARK: 84R5196; PACKAGE: SOT23-5; SUPPLIER: Microchip
IMU_FSYNC = pinhead:PINHD-1X1: PIN HEADER
JP1 = pinhead:PINHD-1X3: PIN HEADER
JP2 = pinhead:PINHD-1X6: PIN HEADER
JP3 = con_prog:CON_PROG-6
JP4 = pinhead:PINHD-1X8: PIN HEADER
JP7 = pinhead:PINHD-2X7: PIN HEADER
L1 L3 = rcl_edit:L-EU: INDUCTOR, European symbol
L4 L5 L8 = rcl_upravena:L-US: INDUCTOR, American symbol
L14 = Inductor-XAL7030:XAL7030; FARNELL: 2289107; PN: XAL7030-102MEC
NC1-NC4 NC24 NC28 NC29 NC59-NC65 = NC:NC: _EXTERNAL_
PWR-SHDN = pinhead:PINHD-2X2: PIN HEADER
Q1 Q13 Q17 = transistors:P-MOSFET
Q2 = xtal:ABM8; OC_FARNELL: 2471850
Q3 Q4 Q7 Q8 Q14 = transistors:N-MOSFET; OC_FARNELL: 2543537
Q5 Q6 Q9 Q10 Q18 = on-semiconductor-ntjd5121nt1g:NTJD5121NT1G: NTJD5121N, Dual N−Channel with ESD Power MOSFET 60 V, 295 mA, Dual N−Channel with ESD Protection, SC−88 Source: Datasheet <http://www.farnell.com/datasheets/1708304.pdf>; MF: ON SEMICONDUCTOR; MPN: NTJD5121NT1G; OC_FARNELL: 2317611; OC_NEWARK: unknown
R1-R65 R70-R79 R87 R88 R92 R94 R98-R100 R108 R117-R133 R135 R136 R138-R148 R151 R152 R154-R157 R159-R163 R165-R167 R169 R170 = microbuilder:RESISTOR: Resistors 0402 - 0402 Surface Mount Package 22 Ohm 1% 1/16W [Digikey: 311-22.0LRTR-ND] 33 Ohm 5% 1/16W 1.0K 5% 1/16W 1.5K 5% 1/16W 2.0K 1% 1/16W 10.0K 1% 1/16W [Digikey: 311-10.0KLRTR-ND] 10.0K 5% 1/16W [Digikey: RMCF0402JT10K0TR-ND] 12.1K 1% 1/16W [Digikey: 311-22.0LRTR-ND] 100.0K 5% 1/16W 0603 - 0603 Surface Mount Package 0 Ohm 1/10 Watt 1% Resistor 15 Ohm 1/10 Watt 1% Resistor 33 Ohm 1/10 Watt 1% Resistor 49.9 Ohm 1/10 Watt 1% Resistor 100 Ohm 1/10 Watt 1% Resistor 150 Ohm 1/10 Watt 1% Resistor 240 Ohm 1/10 Watt 1% Resistor 390 Ohm 1/10 Watt 1% Resistor 560 Ohm 1/10 Watt 1% Resistor 680 Ohm 1/10 Watt 1% Resistor 750 Ohm 1/10 Watt 1% Resistor 1.0K Ohm 1/10 Watt 1% Resistor 1.5K Ohm 1/10 Watt 1% Resistor 2.0K Ohm 1/10 Watt 1% Resistor 2.2K Ohm 1/10 Watt 1% Resistor 3.3K Ohm 1/10 Watt 1% Resistor 4.7K Ohm 1/10 Watt 1% Resistor 10.0K Ohm 1/10 Watt 1% Resistor 12.0K Ohm 1/10 Watt 1% Resistor 12.1K Ohm 1/10 Watt 1% Resistor 20.0K Ohm 1/10 Watt 1% Resistor 33.0K Ohm 1/10 Watt 1% Resistor 100.0K Ohm 1/10 Watt 1% Resistor 0805 - 0805 Surface Mount Package 0 Ohm 1/8 Watt 1% Resistor 33 Ohm 1/8 Watt 1% Resistor 100 Ohm 1/8 Watt 1% Resistor 150 Ohm 1/8 Watt 1% Resistor 200 Ohm 1/8 Watt 1% Resistor 240 Ohm 1/8 Watt 1% Resistor 330 Ohm 1/8 Watt 1% Resistor 390 Ohm 1/8 Watt 1% Resistor 470 Ohm 1/8 Watt 1% Resistor 1.0K Ohm 1/8 Watt 1% Resistor 1.5K Ohm 1/8 Watt 1% Resistor 2.0K Ohm 1/8 Watt 1% Resistor 4.7K Ohm 1/8 Watt 1% Resistor 5.1K Ohm 1/8 Watt 1% Resistor 5.6K Ohm 1/8 Watt 1% Resistor 10.0K Ohm 1/8 Watt 1% Resistor 22.0K Ohm 1/8 Watt 1% Resistor 33.0K Ohm 1/8 Watt 1% Resistor 100K Ohm 1/8 Watt 1% Resistor 1206 - 1206 Surface Mount Package 2012 - 2010 Surface Mount Package 0.11 Ohm 1/2 Watt 1% Resistor - Digikey: RHM.11UCT-ND
RN1-RN14 = resistor-array:742-8_MULTI
SENSOR_I2C = pinhead:PINHD-1X4: PIN HEADER
U1 = current_monitor:INA213AIDCKT: BIDIRECTIONAL CURRENT SHUNT MONITOR; MPN: INA210AIDCKT; PACKAGE: SC-70-6; SUPPLIER: Texas Instruments
U5_STEP-UP = USB_VBUS_stepUP-tps61236:TPS61236; PN: TPS61236
U$1 = FRDM-KL25Z+KL46Z+K64F:FRDM-KL25Z+KL46Z+K64F_MORE_PINS
U$3 = LDC1614_WQFN:LDC1614-WQFN
U$4 = invensense:MPU-9250
X3 = usb:USB